# EAGLE design PoE_Atmega_REVB (EAGLE 8.3.1)
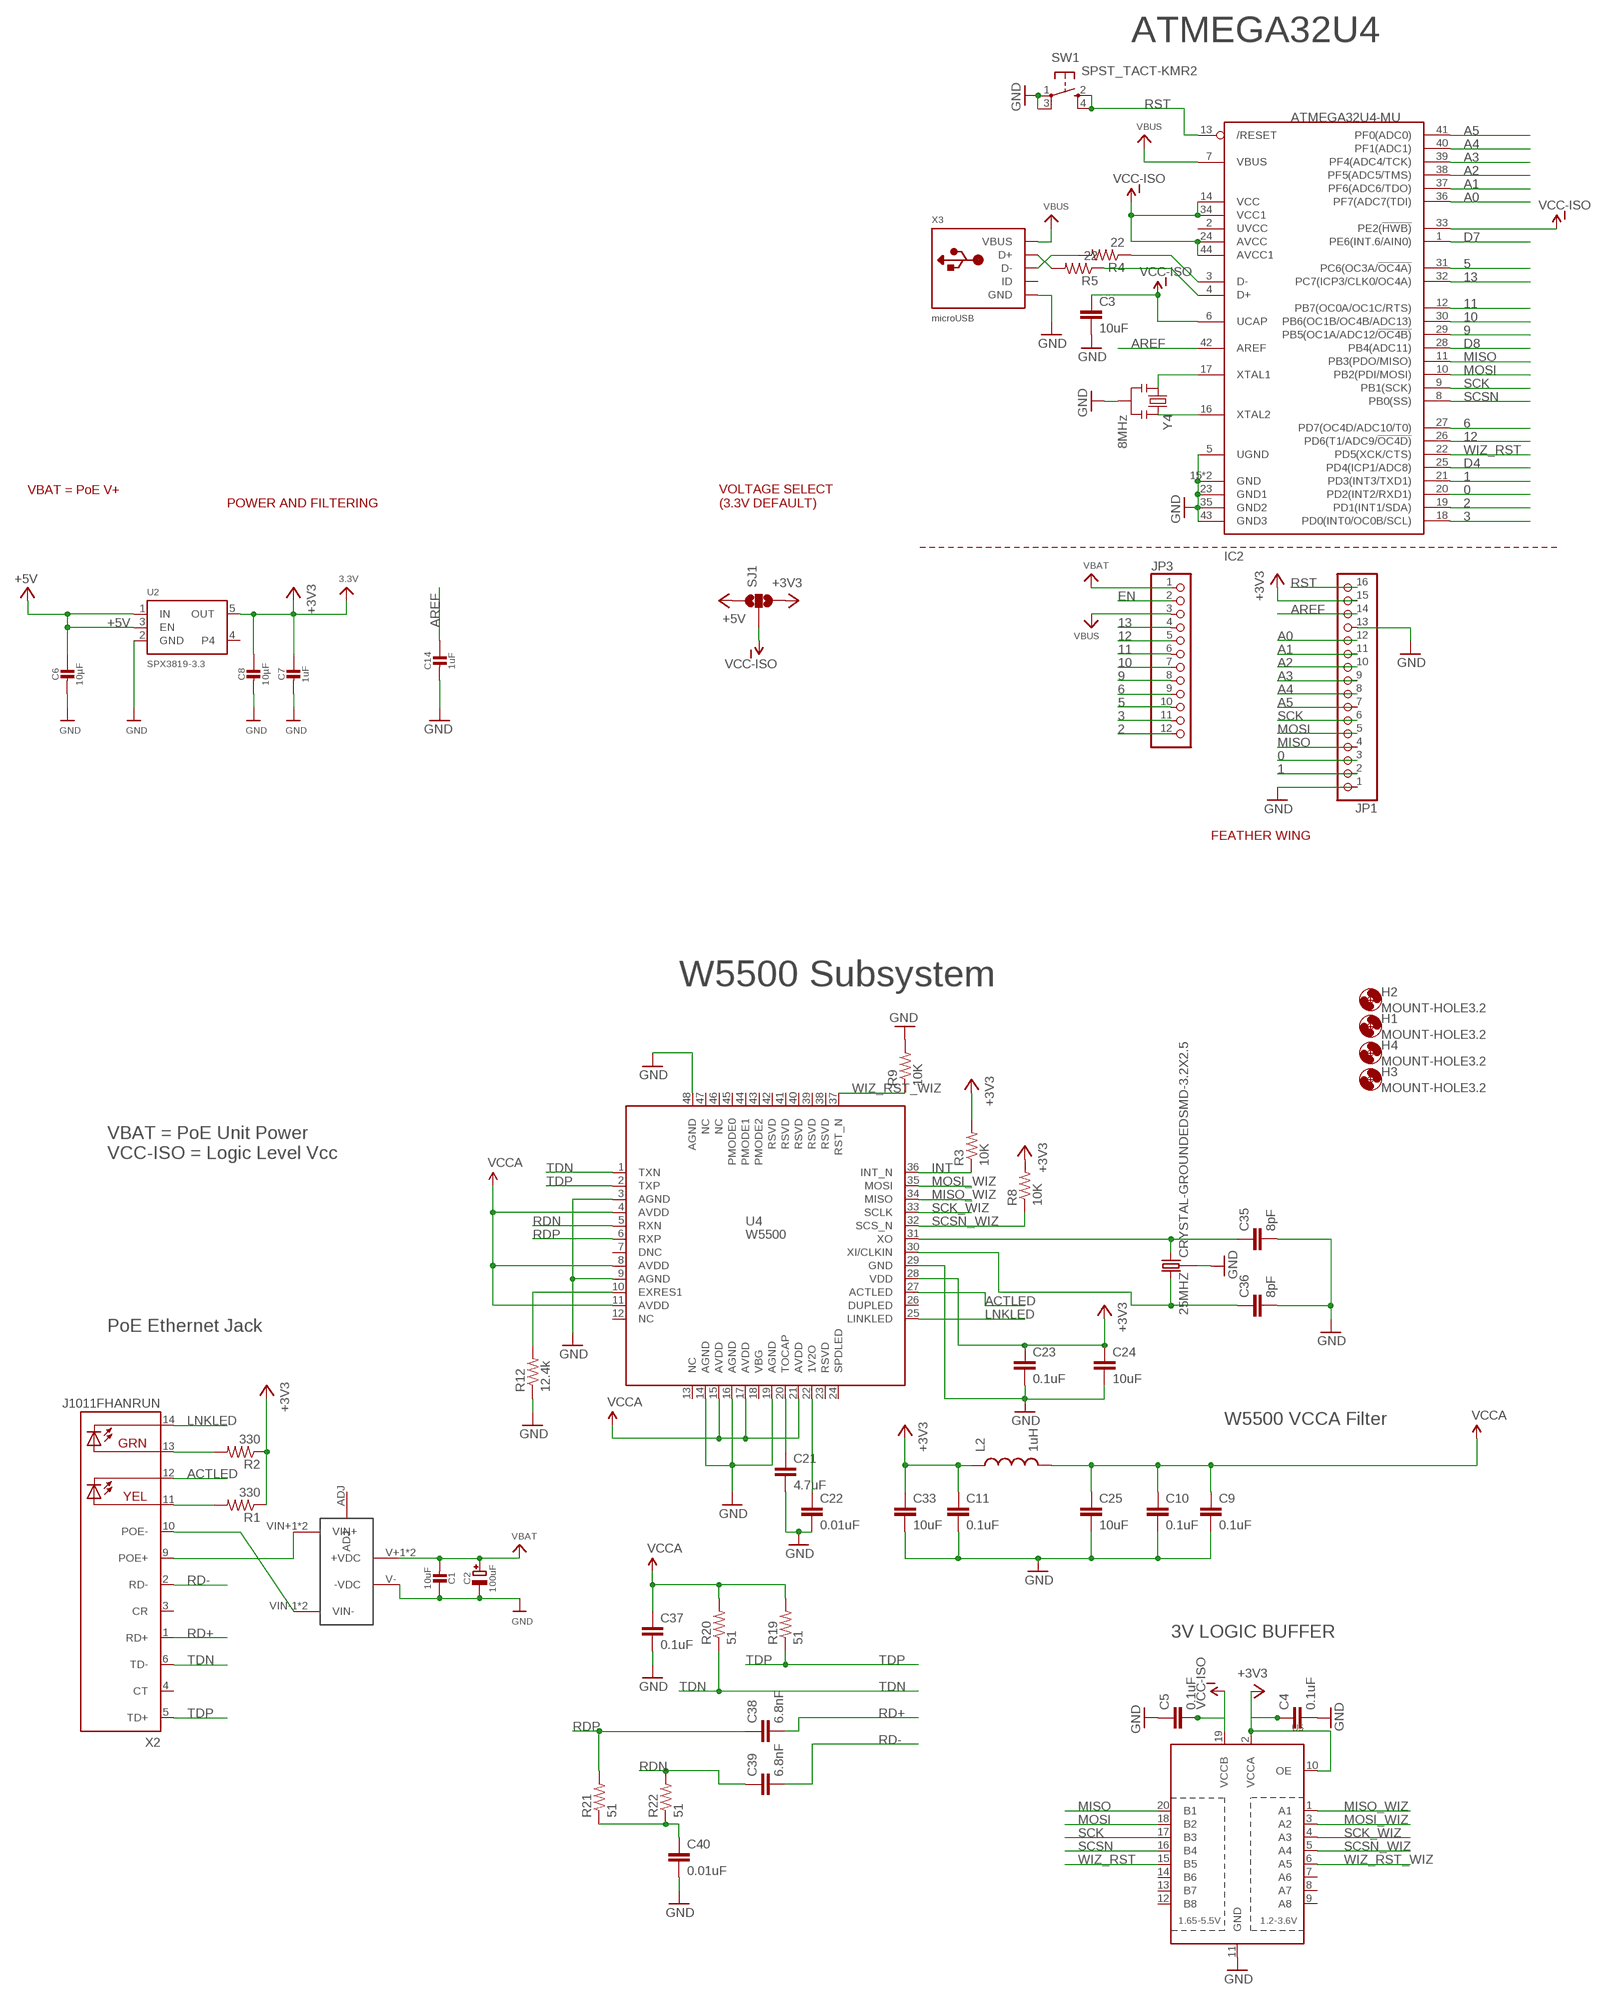
[diagram p0: schematic, sheet 1, part 1 of 2]
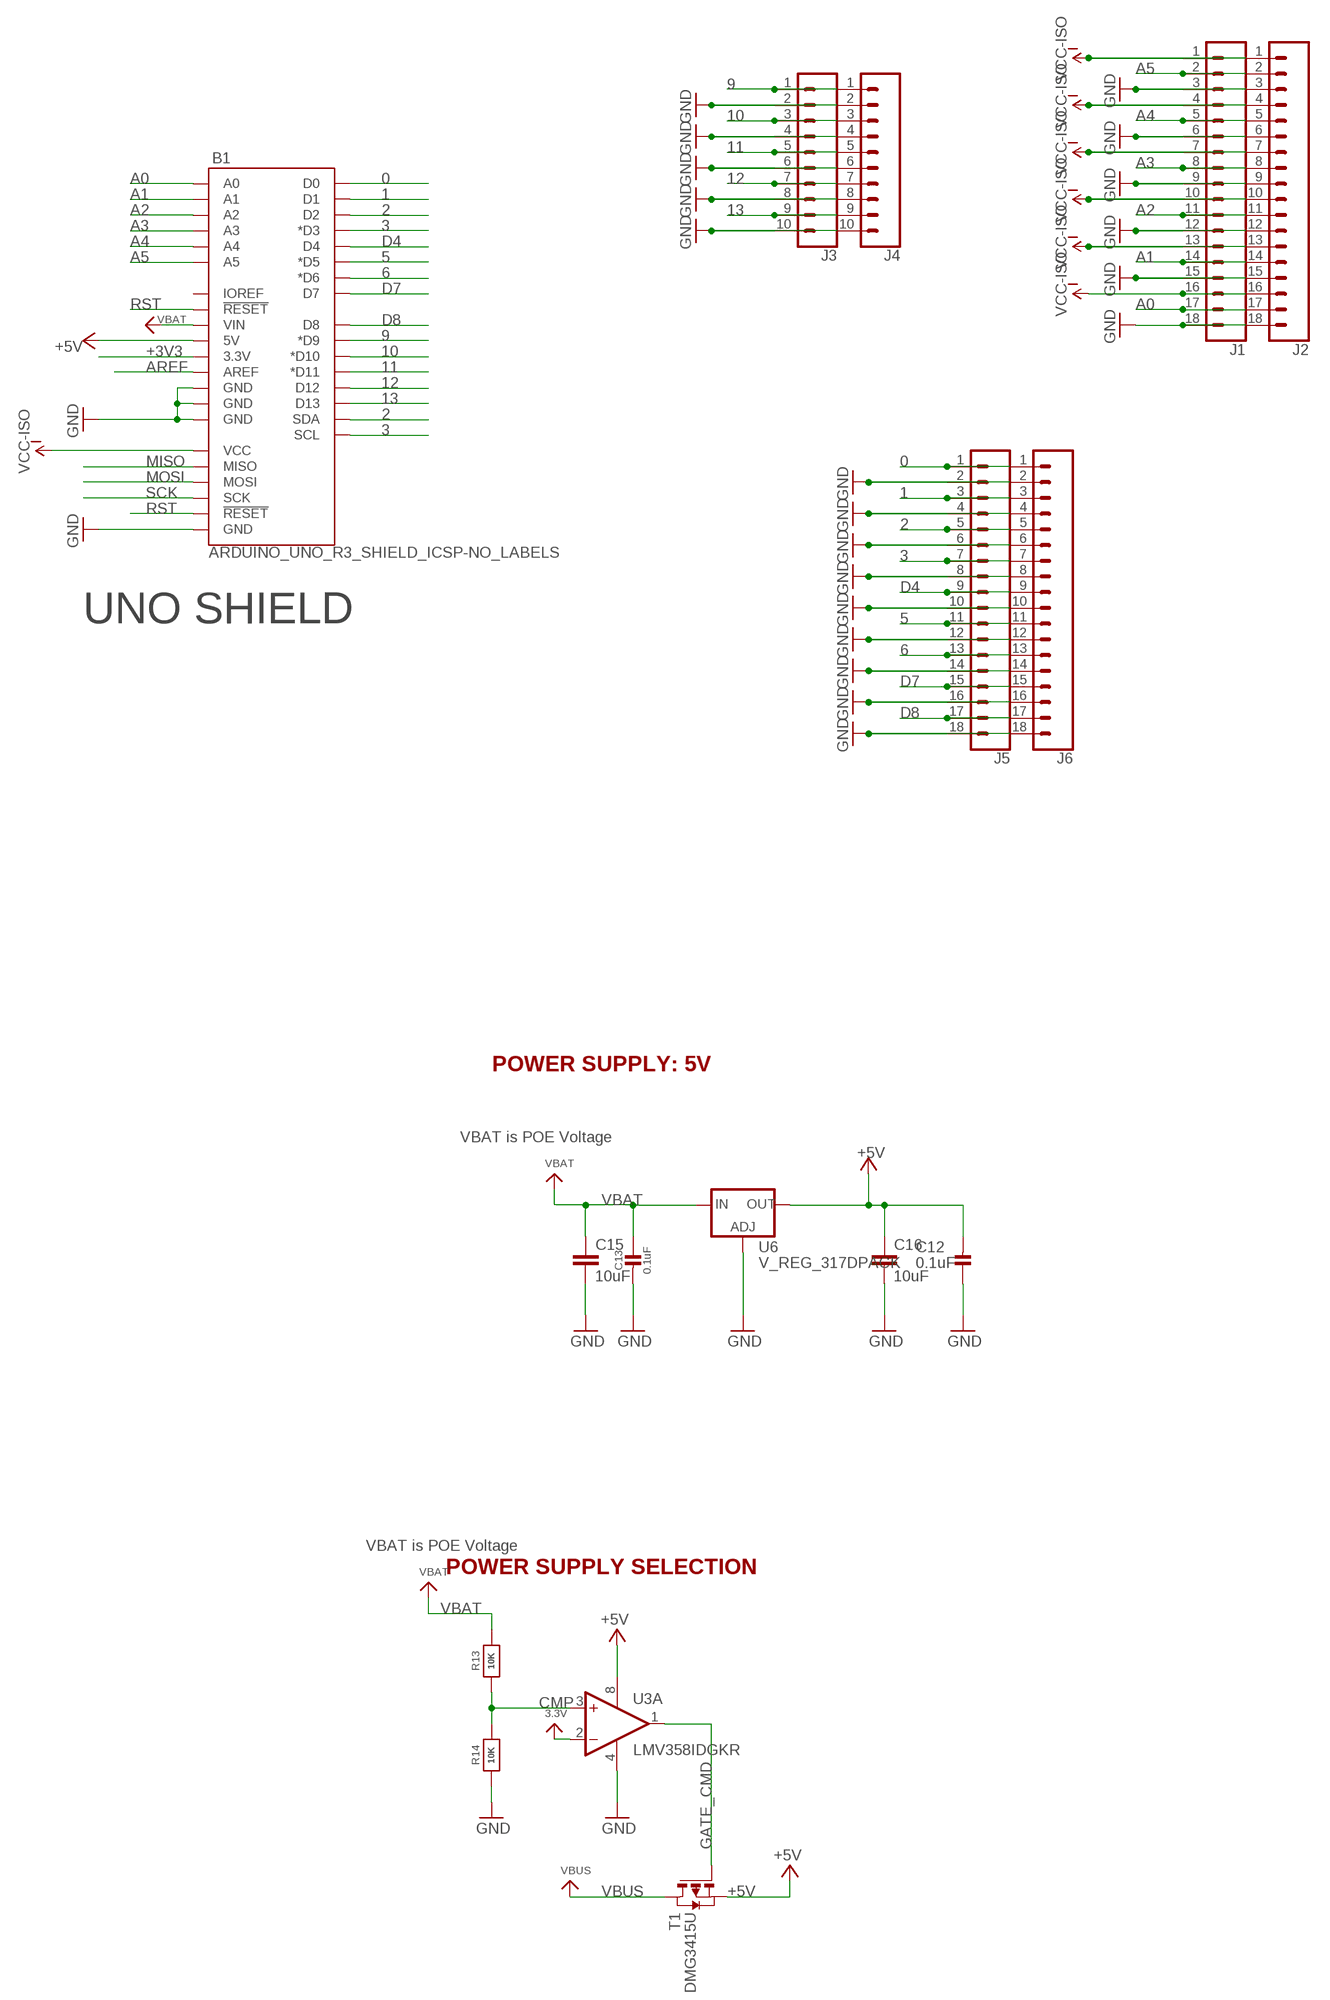
[diagram p1: schematic, sheet 1, part 2 of 2]

## Parts
25MHZ  CRYSTAL-GROUNDEDSMD-3.2X2.5  [CRYSTAL-SMD-3.2X2.5MM]
B1  ARDUINO_UNO_R3_SHIELD_ICSP-NO_LABELS  [UNO_R3_SHIELD_ICSP_NOLABELS]
C1  10uF  CAP_CERAMIC_0805MP  [_0805MP]
C2  100uF  CAP_ELECTROLYTICPANASONIC_C  [PANASONIC_C]
C3  10uF  CAP0603-CAP  [0603-CAP]
C4  0.1uF  CAP0603-CAP  [0603-CAP]
C5  0.1uF  CAP0603-CAP  [0603-CAP]
C6  10µF  CAP_CERAMIC0603MINI  [0603-MINI]
C7  1uF  CAP_CERAMIC0603MINI  [0603-MINI]
C8  10µF  CAP_CERAMIC0603MINI  [0603-MINI]
C9  0.1uF  CAP0603-CAP  [0603-CAP]
C10  0.1uF  CAP0603-CAP  [0603-CAP]
C11  0.1uF  CAP0603-CAP  [0603-CAP]
C12  0.1uF  CAP_CERAMIC0805-NOOUTLINE  [0805-NO]
C13  0.1uF  CAP_CERAMIC0805-NOOUTLINE  [0805-NO]
C14  1uF  CAP_CERAMIC0603_NO  [0603-NO]
C15  10uF  CAP0603-CAP  [0603-CAP]
C16  10uF  CAP0603-CAP  [0603-CAP]
C21  4.7uF  CAP0603-CAP  [0603-CAP]
C22  0.01uF  CAP0603-CAP  [0603-CAP]
C23  0.1uF  CAP0603-CAP  [0603-CAP]
C24  10uF  CAP0603-CAP  [0603-CAP]
C25  10uF  CAP0603-CAP  [0603-CAP]
C33  10uF  CAP0603-CAP  [0603-CAP]
C35  8pF  CAP0603-CAP  [0603-CAP]
C36  8pF  CAP0603-CAP  [0603-CAP]
C37  0.1uF  CAP0603-CAP  [0603-CAP]
C38  6.8nF  CAP0603-CAP  [0603-CAP]
C39  6.8nF  CAP0603-CAP  [0603-CAP]
C40  0.01uF  CAP0603-CAP  [0603-CAP]
H1  MOUNT-HOLE3.2  [3,2]
H2  MOUNT-HOLE3.2  [3,2]
H3  MOUNT-HOLE3.2  [3,2]
H4  MOUNT-HOLE3.2  [3,2]
IC2  ATMEGA32U4-MU  [TQFN44_7MM]
J1  CONN_18  [1X18]
J2  CONN_18  [1X18]
J3  CONN_10"  [1X10]
J4  CONN_10"  [1X10]
J5  CONN_18  [1X18]
J6  CONN_18  [1X18]
JP1  HEADER-1X16ROUND  [1X16_ROUND]
JP3  HEADER-1X12  [1X12_ROUND]
L2  1uH  INDUCTOR0603  [0603]
R1  330  RESISTOR0603-RES  [0603-RES]
R2  330  RESISTOR0603-RES  [0603-RES]
R3  10K  RESISTOR0603-RES  [0603-RES]
R4  22  RESISTOR0603-RES  [0603-RES]
R5  22  RESISTOR0603-RES  [0603-RES]
R8  10K  RESISTOR0603-RES  [0603-RES]
R9  10K  RESISTOR0603-RES  [0603-RES]
R12  12.4k  RESISTOR0603-RES  [0603-RES]
R13  10K  RESISTOR0805_NOOUTLINE  [0805-NO]
R14  10K  RESISTOR0805_NOOUTLINE  [0805-NO]
R19  51  RESISTOR0603-RES  [0603-RES]
R20  51  RESISTOR0603-RES  [0603-RES]
R21  51  RESISTOR0603-RES  [0603-RES]
R22  51  RESISTOR0603-RES  [0603-RES]
SJ1  SOLDERJUMPER_2WAYPASTE2&3  [SJ_3_PASTE2&3]
SW1  SPST_TACT-KMR2  [KMR2]
T1  DMG3415U  PMOSSOT23  [SOT-23]
U2  SPX3819-3.3  VREG_SOT23-5  [SOT23-5]
U3  LMV358IDGKR  LMV358MMX  [MSOP08]
U4  W5500  [W5500]
U5  TXB0108PWR  [TSSOP20]
U6  V_REG_317DPACK  [V-REG_DPACK]
U$1  SILVERTEL_POEMICRO  [AG9900]
X2  J1011FHANRUN  [HANRUN_POE]
X3  microUSB  USB_MICRO_20329_V2  [4UCONN_20329_V2]
Y4  8MHz  RESONATORSMD  [RESONATOR-SMD]

## Nets
0: B1.RX(D0) IC2.20(PD2(INT2/RXD1)) J5.1 J6.1 JP1.3
1: B1.TX(D1) IC2.21(PD3(INT3/TXD1)) J5.3 J6.3 JP1.2
2: B1.D2 B1.SDA IC2.19(PD1(INT1/SDA)) J5.5 J6.5 JP3.12
3: B1.D3(*D3) B1.SCL IC2.18(PD0(INT0/OC0B/SCL)) J5.7 J6.7 JP3.11
5: B1.D5(*D5) IC2.31(PC6(OC3A/!OC4A)) J5.11 J6.11 JP3.10
6: B1.D6(*D6) IC2.27(PD7(OC4D/ADC10/T0)) J5.13 J6.13 JP3.9
9: B1.D9(*D9) IC2.29(PB5(OC1A/ADC12/!OC4B)) J3.1 J4.1 JP3.8
10: B1.D10(*D10) IC2.30(PB6(OC1B/OC4B/ADC13)) J3.3 J4.3 JP3.7
11: B1.D11(*D11) IC2.12(PB7(OC0A/OC1C/RTS)) J3.5 J4.5 JP3.6
12: B1.D12 IC2.26(PD6(T1/ADC9/!OC4D)) J3.7 J4.7 JP3.5
13: B1.D13 IC2.32(PC7(ICP3/CLK0/OC4A)) J3.9 J4.9 JP3.4
+3V3: B1.3.3V C4.1 C7.1 C8.1 C11.1 C23.1 C24.1 C33.1 JP1.15 L2.1 R1.1 R2.1 R3.2 R8.2 SJ1.3 U2.5(OUT) U3.2(A:-IN) U4.28(VDD) U5.2(VCCA) U5.10(OE) ; supply symbol labelled 3.3V
+5V [usbvcc]: B1.5V C6.1 C12.2 C16.1 SJ1.1 T1.2(S) U2.1(IN) U2.3(EN) U3.8(P:V+) U6.4(OUT)
A0: B1.A0 IC2.36(PF7(ADC7(TDI)) J1.17 J2.17 JP1.12
A1: B1.A1 IC2.37(PF6(ADC6/TDO)) J1.14 J2.14 JP1.11
A2: B1.A2 IC2.38(PF5(ADC5/TMS)) J1.11 J2.11 JP1.10
A3: B1.A3 IC2.39(PF4(ADC4/TCK)) J1.8 J2.8 JP1.9
A4: B1.A4 IC2.40(PF1(ADC1)) J1.5 J2.5 JP1.8
A5: B1.A5 IC2.41(PF0(ADC0)) J1.2 J2.2 JP1.7
ACTLED: U4.27(ACTLED) X2.12(YEL-C)
AREF: B1.AREF C14.1 IC2.42(AREF) JP1.14
CMP: R13.1 R14.2 U3.3(A:+IN)
D4: B1.D4 IC2.25(PD4(ICP1/ADC8)) J5.9 J6.9
D7: B1.D7 IC2.1(PE6(INT.6/AIN0)) J5.15 J6.15
D8: B1.D8 IC2.28(PB4(ADC11)) J5.17 J6.17
D+: IC2.4(D+) R5.1
D-: IC2.3(D-) R4.1
EN: JP3.2
GATE_CMD: T1.3(G) U3.1(A:OUT)
GND: 25MHZ.2 25MHZ.4 B1.GND@0(GND) B1.GND@1(GND) B1.GND@2(GND) B1.GND_ICSP(GND) C1.1 C2.- C3.2 C4.2 C5.1 C6.2 C7.2 C8.2 C9.2 C10.2 C11.2 C12.1 C13.2 C14.2 C15.2 C16.2 C21.2 C22.2 C23.2 C24.2 C25.2 C33.2 C35.2 C36.2 C37.2 C40.2 IC2.5(UGND) IC2.15(GND) IC2.23(GND1) IC2.35(GND2) IC2.43(GND3) IC2.THERMAL(GND) J1.3 J1.6 J1.9 J1.12 J1.15 J1.18 J2.3 J2.6 J2.9 J2.12 J2.15 J2.18 J3.2 J3.4 J3.6 J3.8 J3.10 J4.2 J4.4 J4.6 J4.8 J4.10 J5.2 J5.4 J5.6 J5.8 J5.10 J5.12 J5.14 J5.16 J5.18 J6.2 J6.4 J6.6 J6.8 J6.10 J6.12 J6.14 J6.16 J6.18 JP1.1 JP1.13 R9.2 R12.1 R14.1 SW1.1(P) SW1.3(P1) U2.2(GND) U3.4(P:V-) U4.3(AGND) U4.9(AGND) U4.14(AGND) U4.16(AGND) U4.19(AGND) U4.29(GND) U4.48(AGND) U5.11(GND) U6.1(ADJ) U$1.V-(-VDC) X3.BASE@1(GND) X3.BASE@2(GND) X3.GND X3.SPRT@1(GND) X3.SPRT@2(GND) X3.SPRT@3(GND) X3.SPRT@4(GND) Y4.2
INT: R3.1 U4.36(INT_N)
LNKLED: U4.25(LINKLED) X2.14(GRN-C)
MISO: B1.MISO IC2.11(PB3(PDO/MISO)) JP1.4 U5.20(B1)
MISO_WIZ: U4.34(MISO) U5.1(A1)
MOSI: B1.MOSI IC2.10(PB2(PDI/MOSI)) JP1.5 U5.18(B2)
MOSI_WIZ: U4.35(MOSI) U5.3(A2)
N$6: R5.2 X3.D+
N$9: R1.2 X2.11(YEL-A)
N$10: R2.2 X2.13(GRN-A)
N$11: IC2.16(XTAL2) Y4.3
N$12: IC2.17(XTAL1) Y4.1
N$13: R4.2 X3.D-
N$18: C21.1 U4.20(TOCAP)
N$19: C22.1 U4.22(1V2O)
N$20: R12.2 U4.10(EXRES1)
N$23: C40.1 R21.1 R22.1
N$25: 25MHZ.3 C35.1 U4.31(XO)
N$26: 25MHZ.1 C36.1 U4.30(XI/CLKIN)
POE_VIN+: U$1.VIN+1(VIN+) U$1.VIN+2(VIN+) X2.9(POE+)
POE_VIN-: U$1.VIN-1(VIN-) U$1.VIN-2(VIN-) X2.10(POE-)
RD+: C38.2 X2.1(RD+)
RD-: C39.2 X2.2(RD-)
RDN: C39.1 R22.2 U4.5(RXN)
RDP: C38.1 R21.2 U4.6(RXP)
RST: B1.RES(!RESET!) B1.RST_ICSP(!RESET!) IC2.13(/RESET) JP1.16 SW1.2(S) SW1.4(S1)
SCK: B1.SCK IC2.9(PB1(SCK)) JP1.6 U5.17(B3)
SCK_WIZ: U4.33(SCLK) U5.4(A3)
SCSN: IC2.8(PB0(SS)) U5.16(B4)
SCSN_WIZ: R8.1 U4.32(SCS_N) U5.5(A4)
TDN: R20.1 U4.1(TXN) X2.6(TD-)
TDP: R19.1 U4.2(TXP) X2.5(TD+)
VBAT: B1.VIN C1.2 C2.+ C13.1 C15.1 JP3.1 R13.2 U6.3(IN) U$1.V+1(+VDC) U$1.V+2(+VDC)
VBUS: IC2.7(VBUS) JP3.3 T1.1(D) X3.VBUS
VCC-ISO: B1.5V_ICSP(VCC) C3.1 C5.2 IC2.6(UCAP) IC2.14(VCC) IC2.24(AVCC) IC2.33(PE2(!HWB)) IC2.34(VCC1) IC2.44(AVCC1) J1.1 J1.4 J1.7 J1.10 J1.13 J1.16 J2.1 J2.4 J2.7 J2.10 J2.13 J2.16 SJ1.2 U5.19(VCCB)
VCCA: C9.1 C10.1 C25.1 C37.1 L2.2 R19.2 R20.2 U4.4(AVDD) U4.8(AVDD) U4.11(AVDD) U4.15(AVDD) U4.17(AVDD) U4.21(AVDD)
WIZ_RST: IC2.22(PD5(XCK/CTS)) U5.15(B5)
WIZ_RST_WIZ: R9.1 U4.37(RST_N) U5.6(A5)
Unconnected: B1.IOREF IC2.2(UVCC) U2.4 U3.5(B:+IN) U3.6(B:-IN) U3.7(B:OUT) U4.7(DNC) U4.12(NC) U4.13(NC) U4.18(VBG) U4.23(RSVD) U4.24(SPDLED) U4.26(DUPLED) U4.38(RSVD) U4.39(RSVD) U4.40(RSVD) U4.41(RSVD) U4.42(RSVD) U4.43(PMODE2) U4.44(PMODE1) U4.45(PMODE0) U4.46(NC) U4.47(NC) U5.7(A6) U5.8(A7) U5.9(A8) U5.12(B8) U5.13(B7) U5.14(B6) U$1.ADJ X2.3(CR) X2.4(CT) X3.ID

## Notes on the sheet
- ATMEGA32U4
- VBAT = PoE V+
- POWER AND FILTERING
- VOLTAGE SELECT
  (3.3V DEFAULT)
- UNO SHIELD
- FEATHER WING
- W5500 Subsystem
- VBAT = PoE Unit Power
  VCC-ISO = Logic Level Vcc
- POWER SUPPLY: 5V
- VBAT is POE Voltage
- PoE Ethernet Jack
- W5500 VCCA Filter
- VBAT is POE Voltage
- POWER SUPPLY SELECTION
- 3V LOGIC BUFFER

## Library data of the parts
25MHZ = SparkFun-Clocks:CRYSTAL-GROUNDED: Crystals w/ Ground Pin (Generic) These are passive quartz crystals, which can be used as a clock source for a microcontroller. Crystal's are usually two-terminal devices. A third terminal may be optionally connected to ground, as recommended by the manufaturer.
B1 = SparkFun-Boards:ARDUINO_UNO_R3_SHIELD_ICSP: Arduino R3 Shield Footprint with ICSP Header Includes pins for 6-pin (2x3) ICSP Header. Compatible with Leonardo boards that require SPI pin connections via this header. SparkFun Products: CryptoShield <https://www.sparkfun.com/products/13183> microSD Shield <https://www.sparkfun.com/products/12761> R3 Stackable Headers Kit <https://www.sparkfun.com/products/1417>
C1 C6-C8 C12-C14 = microbuilder:CAP_CERAMIC: Ceramic Capacitors For new designs, use the packages preceded by an '_' character since they are more reliable: The following footprints should be used on most boards: _0402 - Standard footprint for regular board layouts _0603 - Standard footprint for regular board layouts _0805 - Standard footprint for regular board layouts _1206 - Standard footprint for regular board layouts For extremely tight-pitch boards where space is at a premium, the following 'micro-pitch' footprints can be used (smaller pads, no silkscreen outline, etc.): _0402MP - Micro-pitch footprint for very dense/compact boards _0603MP - Micro-pitch footprint for very dense/compact boards _0805MP - Micro-pitch footprint for very dense/compact boards _1206MP - Micro-pitch footprint for very dense/compact boards
C2 = microbuilder:CAP_ELECTROLYTIC: Electrolytic Capacitors SMT PANASONIC_C - Size C Panasonic Electrolytic Aluminum Capacitor 47µF 16V 20% Electrolytic Capacitor [Digikey: PCE3890TR-ND] PANASONIC_D - Size D Panasonic Electrolytic Aluminum Capacitor 100µF 25V 20% Electrolytic Capacitor [Digikey: PCE3898TR-ND] PTH 3.5 mm grid, 8 mm diameter ... 3.5 mm grid, 10 mm diameter ...
C3-C5 C9-C11 C15 C16 C21-C25 C33 C35-C40 = SparkFun-Passives:CAP: Capacitor Standard 0603 ceramic capacitor, and 0.1" leaded capacitor.
H1-H4 = holes:MOUNT-HOLE: MOUNTING HOLE with drill center marker
IC2 = microbuilder:ATMEGA32U4: http://www.ladyada.net/library/eagle
J1 J2 J5 J6 = SparkFun-Connectors:CONN_18: Multi connection point. Often used as Generic Header-pin footprint for 0.1 inch spaced/style header connections On any of the 0.1 inch spaced packages, you can populate with these: Break Away Headers - Straight <https://www.sparkfun.com/products/116> (PRT-00116) Break Away Male Headers - Right Angle <https://www.sparkfun.com/products/553> (PRT-00553) Female Headers <https://www.sparkfun.com/products/115> (PRT-00115) Break Away Headers - Machine Pin <https://www.sparkfun.com/products/117> (PRT-00117) Break Away Female Headers - Swiss Machine Pin <https://www.sparkfun.com/products/743> (PRT-00743) For SCREWTERMINALS and SPRING TERMINALS visit here: Screw Terimnals on SparkFun.com <https://www.sparkfun.com/search/results?term=Screw+Terminals> (5mm/3.5mm/2.54mm spacing) This device is also useful as a general connection point to wire up your design to another part of your project. Our various solder wires solder well into these plated through hole pads. Hook-Up Wire - Assortment (Stranded, 22 AWG) <https://www.sparkfun.com/products/11375> (PRT-11375) Hook-Up Wire - Assortment (Solid Core, 22 AWG) <https://www.sparkfun.com/products/11367> (PRT-11367) View the entire wire category on our website here <https://www.sparkfun.com/categories/141> Special notes: Molex polarized connector foot print use with SKU : PRT-08231 with associated crimp pins and housings. 1MM SMD Version SKU: PRT-10208 NOTES ON THE VARIANTS LOCK and LOCK_LONGPADS... This footprint was designed to help hold the alignment of a through-hole component (i.e. 6-pin header) while soldering it into place. You may notice that each hole has been shifted either up or down by 0.005 of an inch from it's more standard position (which is a perfectly straight line). This slight alteration caused the pins (the squares in the middle) to touch the edges of the holes. Because they are alternating, it causes a "brace" to hold the component in place. 0.005 has proven to be the perfect amount of "off-center" position when using our standard breakaway headers. Although looks a little odd when you look at the bare footprint, once you have a header in there, the alteration is very hard to notice. Also,if you push a header all the way into place, it is covered up entirely on the bottom side.
J3 J4 = SparkFun-Connectors:CONN_10: Multi connection point. Often used as Generic Header-pin footprint for 0.1 inch spaced/style header connections On any of the 0.1 inch spaced packages, you can populate with these: Break Away Headers - Straight <https://www.sparkfun.com/products/116> (PRT-00116) Break Away Male Headers - Right Angle <https://www.sparkfun.com/products/553> (PRT-00553) Female Headers <https://www.sparkfun.com/products/115> (PRT-00115) Break Away Headers - Machine Pin <https://www.sparkfun.com/products/117> (PRT-00117) Break Away Female Headers - Swiss Machine Pin <https://www.sparkfun.com/products/743> (PRT-00743) Arduino Stackable Header - 10 Pin <https://www.sparkfun.com/products/11376> (PRT-11376) For SCREWTERMINALS and SPRING TERMINALS visit here: Screw Terimnals on SparkFun.com <https://www.sparkfun.com/search/results?term=Screw+Terminals> (5mm/3.5mm/2.54mm spacing) This device is also useful as a general connection point to wire up your design to another part of your project. Our various solder wires solder well into these plated through hole pads. Hook-Up Wire - Assortment (Stranded, 22 AWG) <https://www.sparkfun.com/products/11375> (PRT-11375) Hook-Up Wire - Assortment (Solid Core, 22 AWG) <https://www.sparkfun.com/products/11367> (PRT-11367) View the entire wire category on our website here <https://www.sparkfun.com/categories/141> Special notes: Molex polarized connector foot print use with SKU : PRT-08231 with associated crimp pins and housings. 1MM SMD Version SKU: PRT-10208 NOTES ON THE VARIANTS LOCK and LOCK_LONGPADS... This footprint was designed to help hold the alignment of a through-hole component (i.e. 6-pin header) while soldering it into place. You may notice that each hole has been shifted either up or down by 0.005 of an inch from it's more standard position (which is a perfectly straight line). This slight alteration caused the pins (the squares in the middle) to touch the edges of the holes. Because they are alternating, it causes a "brace" to hold the component in place. 0.005 has proven to be the perfect amount of "off-center" position when using our standard breakaway headers. Although looks a little odd when you look at the bare footprint, once you have a header in there, the alteration is very hard to notice. Also,if you push a header all the way into place, it is covered up entirely on the bottom side.; PROD_ID: CONN-11563
JP1 = microbuilder:HEADER-1X16: PIN HEADER
JP3 = microbuilder:HEADER-1X12
L2 = SparkFun-Passives:INDUCTOR: Inductors Basic Inductor/Choke - 0603 and 1206. Footprints are not proven and vary greatly between part numbers. INDUCTOR POWER 3.3UH 4.0A SMD 0.197" L x 0.197" W x 0.177" H (5.00mm x 5.00mm x 4.50mm)
R1-R5 R8 R9 R12 R19-R22 = SparkFun-Passives:RESISTOR: Resistor Basic schematic elements and footprints for 0603, 1206, and PTH resistors.
R13 R14 = microbuilder:RESISTOR: Resistors For new designs, use the packages preceded by an '_' character since they are more reliable: The following footprints should be used on most boards: _0402 - Standard footprint for regular board layouts _0603 - Standard footprint for regular board layouts _0805 - Standard footprint for regular board layouts _1206 - Standard footprint for regular board layouts For extremely tight-pitch boards where space is at a premium, the following 'micro-pitch' footprints can be used (smaller pads, no silkscreen outline, etc.): _0402MP - Micro-pitch footprint for very dense/compact boards _0603MP - Micro-pitch footprint for very dense/compact boards _0805MP - Micro-pitch footprint for very dense/compact boards _1206MP - Micro-pitch footprint for very dense/compact boards
SJ1 = SparkFun-Retired:SOLDERJUMPER_2WAY: Solder Jumper 2 way solder jumper
SW1 = adafruit:SPST_TACT: SMT 6mm switch, EVQQ2 series http://www.ladyada.net/library/eagle
T1 = zetex:PMOSSOT23: MOS FET; OC_FARNELL: unknown; OC_NEWARK: unknown
U2 = microbuilder:VREG_SOT23-5: SOT23-5 Fixed Voltage Regulators Part Current Out V Out V In V Dropout θJA (°C/W) TJ (°C) Digikey Part No. ADP121 150mA 3.3V 3.4-5.5V 0.09V @ 150mA -- -- ADP121-AUJZ33R7CT-ND ADP121 150mA 3.0V 3.1-5.5V 0.09V @ 150mA -- -- ADP121-AUJZ30R7CT-ND ADP122 300mA 3.3V 3.4-5.5V 0.085V @ 300mA -- -- ADP122AUJZ-3.3-R7CT-ND ADP1712 300mA 3.3V 3.5-5.5V 0.17V @ 300mA -- -- ADP1712AUJZ-3.3-R7TR-ND AP7311 (Low Cost) 150mA 3.3V 3.5-6V 0.15V @ 150mA -- -- AP7311-33WG-7DICT-ND LD39015M18R 150mA 1.8V 1.9V-5.5V 0.08V @ 100mA -- -- 497-6977-1-ND LP2985A-33DBVR 150mA 3.3V 3.3-16V 0.28V @ 150mA 206 150 296-18479-1-ND MCP1824T-3302E/OT 300mA 3.3V 3.5V-6V 0.2V @ 300mA -- -- MCP1824T-3302E/OTCT-ND MIC5205-2.5YM5 TR 150mA 2.5V 2.7-16V 0.165V @ 150mA -- -- 576-1257-2-ND MIC5205-3.0YM5 TR 150mA 3.0V 3.2V-16V 0.165V @ 150mA -- -- 576-1258-2-ND MIC5205-3.3YM5 TR 150mA 3.3V 3.5V-16V 0.165V @ 150mA -- -- 576-1259-2-ND TPS780330220 150mA 3.3V+2.2V 3.6-5.5V 250mV Max -- -- 296-23332-1-ND TDA3663/N1,135 100mA 3.3V 3.5-45V 0.18V @ 50mA -- -- 568-5343-1-ND Max operating temp can be calculated using θJA, TJ (max junction temperature), and power in watts. Set the "Maximum Ambient Temperature" until it reaches TJ ("Max Junction Temperature"), which is the absolute limit for safe use of the regulator: Heat Sink Temperature Calculator <http://www.daycounter.com/Calculators/Heat-Sink-Temperature-Calculator.phtml> For example, With 12V source into a 3.3V LP2985 and a 30mA load, we are dissipating (12V-3.3V) * 0.03A = 0.261W. With a θJA of 206 °C/W, a TJ of 150°C, and 261mW we can safely use the chip without a heat sink up to 75°C (=147.1°C Junction Temperature).
U3 = linear:LMV358?*: Dual General Purpose, Low Voltage, Rail-to-Rail Output Operational Amplifiers Source: http://www.national.com/mpf/LM/LMV321.html http://www.national.com/dt/lmv_qual.pdf
U4 = W5500:W5500
U5 = adafruit:TXB0108PWR: 8-Bit Bi-Directional Level Shifter 1.2V-3.6V (VCCA) to 1.65V-5.5V (VCCB) bi-directional level shifter with auto direction sensing. Max data rate - VCCA 1.8V: 20Mbps (50ns), VCCA 3.3V: 100Mbps (10ns) Digikey: 296-21527-1-ND
U6 = SparkFun-IC-Power:V_REG_317: Voltage Regulator Standard LM317 adjustable voltage regulator. AOI (Adjust Output Input). Google 'LM317 Calculator' for easy to use app to get the two resistor values needed. 240/720 for 5V output. 240/390 for 3.3V output. Spark Fun Electronics SKU : COM-00527; PROD_ID: IC-09888
U$1 = Heep:SILVERTEL_POE
X2 = Heep:J1011F: PULSEJACK (TM) 1x1 Tab-UP RJ45 10/100 Base-TX RJ45 1x1 Tab-UP with LEDs 8-pin (J1 series) and 6-pin (JP series) integrated magnetics connector, designed to support applications, such as ADSL modems, LAN-on-Motherboard, and Hub and Switches. Source: www.pulseeng.com .. PulseJack-J402.pdf
X3 = microbuilder:USB: USB Connectors USBMINIB - Surface Mount Female Mini-B USB Connector 4UConnector: 06564
Y4 = SparkFun:RESONATOR: Resonator Small SMD resonator. This is the itty bitty 10/20MHz resonators with built in caps. CSTCE10M0G55 and CSTCE20M0V53. Footprint has been reviewed closely but hasn't been tested yet.

## Net classes
1 power: width 0.305 mm, drill 0.483 mm, clearance 0.203 mm
2 gnd: width 0.305 mm, drill 0.483 mm, clearance 0.203 mm
3 usbvcc: width 0.305 mm, drill 0.483 mm, clearance 0.203 mm

## Board
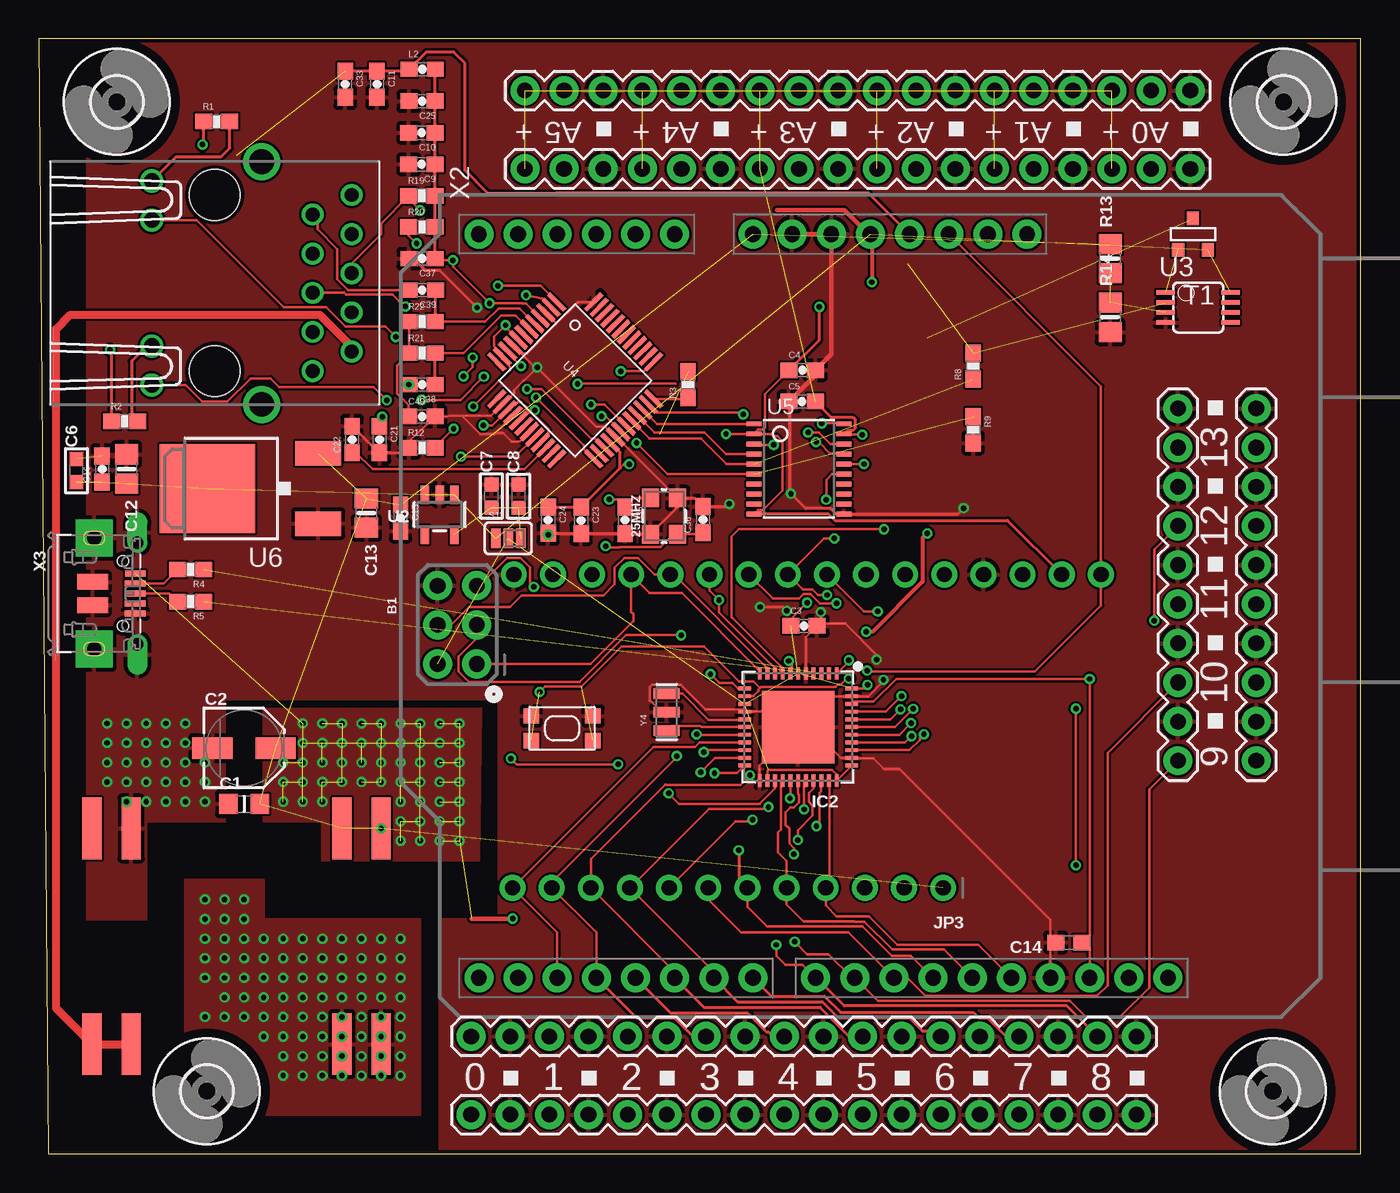
[diagram p2: board, top side]
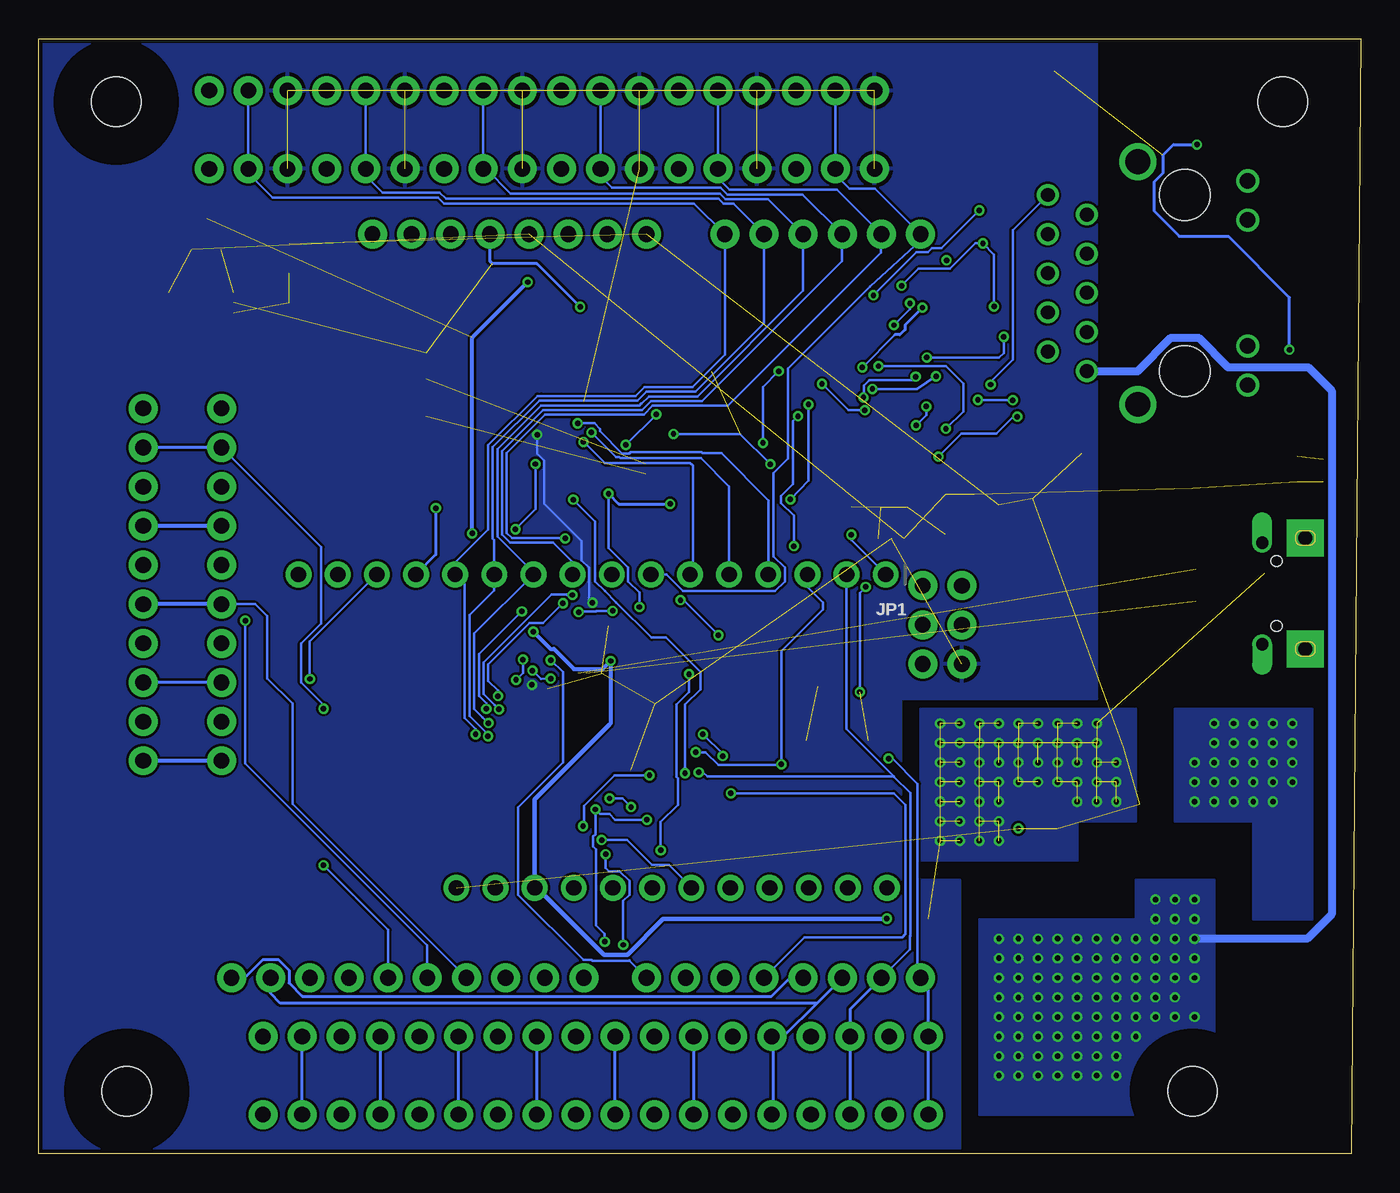
[diagram p3: board, bottom side, seen from below]

Size 85.8 x 72.38 mm. Coordinates in mm from the lower left corner, seen from the top.
Outline: 0.64,0 85.8,0 85.8,72.38 0,72.38 0.64,0
Copper layers (1*16): Top 0.035mm / dielectric 1.5mm / Bottom 0.035mm
Design rules "SeeedStudio_2layer_DRU_no_angle_20140221": minimum track width 6mil, minimum drill 12mil, track to track 6mil, track to pad 6mil, pad to pad 6mil, via to via 6mil, smd to smd 0mil, copper to edge 10mil, drill to drill 10mil, minimum pad ring 10mil, minimum via ring 6mil, stop-mask expansion 2mil, vias tented up to drill 100mil, thermal gap 10mil

### Footprints (pad centres in the part's own frame; a part is rotated, then mirrored left to right if it is on the bottom)
CRYSTAL-SMD-3.2X2.5MM = smd 1.2 x 1.1: 1 -1.175,-0.875; 2 1.175,-0.875; 3 1.175,0.875; 4 -1.175,0.875
UNO_R3_SHIELD_ICSP_NOLABELS = drill 1.016 pad 1.88: 3.3V 24.13,-3.81; 5V 24.13,-1.27; 5V_ICSP -3.76,26.81; A0 24.13,11.43; A1 24.13,13.97; A2 24.13,16.51; A3 24.13,19.05; A4 24.13,21.59; A5 24.13,24.13; AREF -24.13,-15.494; D2 -24.13,19.05; D3 -24.13,16.51; D4 -24.13,13.97; D5 -24.13,11.43; D6 -24.13,8.89; D7 -24.13,6.35; D8 -24.13,2.286; D9 -24.13,-0.254; D10 -24.13,-2.794; D11 -24.13,-5.334; D12 -24.13,-7.874; D13 -24.13,-10.414; GND@0 24.13,1.27; GND@1 24.13,3.81; GND@2 -24.13,-12.954; GND_ICSP 1.32,26.81; IOREF 24.13,-8.89; MISO -3.76,24.27; MOSI -1.22,26.81; NC 24.13,-11.43; RES 24.13,-6.35; RST_ICSP 1.32,24.27; RX -24.13,24.13; SCK -1.22,24.27; SCL -24.13,-20.574; SDA -24.13,-18.034; TX -24.13,21.59; VIN 24.13,6.35
_0805MP = smd 1.2 x 1.3: 1 -1.016,0; 2 1.016,0
PANASONIC_C = smd 2.6 x 1.4: + 2.05,0; - -2.05,0
0603-CAP = smd 1.1 x 1: 1 -0.85,0; 2 0.85,0
0603-MINI = smd 0.9 x 0.9: 1 -0.75,0; 2 0.75,0
0805-NO = smd 1.3 x 1.5: 1 -0.95,0; 2 0.95,0
0603-NO = smd 1.1 x 1: 1 -0.85,0; 2 0.85,0
3,2 = hole 3.2: 0,0
TQFN44_7MM = smd 0.25 x 0.8: 1 -2.5,-3.475; 2 -2,-3.475; 3 -1.5,-3.475; 4 -1,-3.475; 5 -0.5,-3.475; 6 0,-3.475; 7 0.5,-3.475; 8 1,-3.475; 9 1.5,-3.475; 10 2,-3.475; 11 2.5,-3.475; 23 2.5,3.475; 24 2,3.475; 25 1.5,3.475; 26 1,3.475; 27 0.5,3.475; 28 0,3.475; 29 -0.5,3.475; 30 -1,3.475; 31 -1.5,3.475; 32 -2,3.475; 33 -2.5,3.475 | smd 0.8 x 0.25: 12 3.475,-2.5; 13 3.475,-2; 14 3.475,-1.5; 15 3.475,-1; 16 3.475,-0.5; 17 3.475,0; 18 3.475,0.5; 19 3.475,1; 20 3.475,1.5; 21 3.475,2; 22 3.475,2.5; 34 -3.475,2.5; 35 -3.475,2; 36 -3.475,1.5; 37 -3.475,1; 38 -3.475,0.5; 39 -3.475,0; 40 -3.475,-0.5; 41 -3.475,-1; 42 -3.475,-1.5; 43 -3.475,-2; 44 -3.475,-2.5 | smd 4.7 x 4.7: THERMAL 0,0
1X18 = drill 1.016 pad 1.88: 1 0,0; 2 2.54,0; 3 5.08,0; 4 7.62,0; 5 10.16,0; 6 12.7,0; 7 15.24,0; 8 17.78,0; 9 20.32,0; 10 22.86,0; 11 25.4,0; 12 27.94,0; 13 30.48,0; 14 33.02,0; 15 35.56,0; 16 38.1,0; 17 40.64,0; 18 43.18,0
1X10 = drill 1.016 pad 1.88: 1 0,0; 2 2.54,0; 3 5.08,0; 4 7.62,0; 5 10.16,0; 6 12.7,0; 7 15.24,0; 8 17.78,0; 9 20.32,0; 10 22.86,0
1X16_ROUND = drill 1 pad 1.676: 1 -19.05,0; 2 -16.51,0; 3 -13.97,0; 4 -11.43,0; 5 -8.89,0; 6 -6.35,0; 7 -3.81,0; 8 -1.27,0; 9 1.27,0; 10 3.81,0; 11 6.35,0; 12 8.89,0; 13 11.43,0; 14 13.97,0; 15 16.51,0; 16 19.05,0
1X12_ROUND = drill 1 pad 1.676: 1 -13.97,0; 2 -11.43,0; 3 -8.89,0; 4 -6.35,0; 5 -3.81,0; 6 -1.27,0; 7 1.27,0; 8 3.81,0; 9 6.35,0; 10 8.89,0; 11 11.43,0; 12 13.97,0
0603 = smd 1.1 x 1: 1 -0.85,0; 2 0.85,0
0603-RES = smd 1.1 x 1: 1 -0.85,0; 2 0.85,0
SJ_3_PASTE2&3 = smd 0.635 x 1.27: 1 -0.813,0; 2 0,0; 3 0.813,0
KMR2 = smd 1 x 1: 1 2,0.8; 2 2,-0.8; 3 -2,0.8; 4 -2,-0.8
SOT-23 = smd 0.787 x 0.889: 1 0.025,-1.016; 2 -0.94,1.016; 3 0.991,1.016
SOT23-5 = smd 0.55 x 1.2: 1 -0.95,-1.3; 2 0,-1.3; 3 0.95,-1.3; 4 0.95,1.3; 5 -0.95,1.3
MSOP08 = smd 0.3 x 1.2: 1 -0.976,-2.113; 2 -0.326,-2.113; 3 0.324,-2.113; 4 0.974,-2.113; 5 0.974,2.112; 6 0.324,2.112; 7 -0.326,2.112; 8 -0.976,2.112
W5500 = smd 1.5 x 0.3: 1 -4.45,2.75; 2 -4.45,2.25; 3 -4.45,1.75; 4 -4.45,1.25; 5 -4.45,0.75; 6 -4.45,0.25; 7 -4.45,-0.25; 8 -4.45,-0.75; 9 -4.45,-1.25; 10 -4.45,-1.75; 11 -4.45,-2.25; 12 -4.45,-2.75; 25 4.45,-2.75; 26 4.45,-2.25; 27 4.45,-1.75; 28 4.45,-1.25; 29 4.45,-0.75; 30 4.45,-0.25; 31 4.45,0.25; 32 4.45,0.75; 33 4.45,1.25; 34 4.45,1.75; 35 4.45,2.25; 36 4.45,2.75 | smd 0.3 x 1.5: 13 -2.75,-4.45; 14 -2.25,-4.45; 15 -1.75,-4.45; 16 -1.25,-4.45; 17 -0.75,-4.45; 18 -0.25,-4.45; 19 0.25,-4.45; 20 0.75,-4.45; 21 1.25,-4.45; 22 1.75,-4.45; 23 2.25,-4.45; 24 2.75,-4.45; 37 2.75,4.45; 38 2.25,4.45; 39 1.75,4.45; 40 1.25,4.45; 41 0.75,4.45; 42 0.25,4.45; 43 -0.25,4.45; 44 -0.75,4.45; 45 -1.25,4.45; 46 -1.75,4.45; 47 -2.25,4.45; 48 -2.75,4.45
TSSOP20 = smd 0.305 x 0.991: 1 -2.925,-2.918; 2 -2.275,-2.918; 3 -1.625,-2.918; 4 -0.975,-2.918; 5 -0.325,-2.918; 6 0.325,-2.918; 7 0.975,-2.918; 8 1.625,-2.918; 9 2.275,-2.918; 10 2.925,-2.918; 11 2.925,2.918; 12 2.275,2.918; 13 1.625,2.918; 14 0.975,2.918; 15 0.325,2.918; 16 -0.325,2.918; 17 -0.975,2.918; 18 -1.625,2.918; 19 -2.275,2.918; 20 -2.925,2.918
V-REG_DPACK = smd 1.6 x 3: 1 -2.28,-4.8; 3 2.28,-4.8 | smd 5.8 x 6.2: 4 0,2.38
AG9900 = smd 1.25 x 4: ADJ 18.75,0; V+1 0,0; V+2 2.54,0; V- 16.21,0; VIN+1 18.75,14; VIN+2 16.21,14; VIN-1 2.54,14; VIN-2 0,14
HANRUN_POE = drill 0.9 pad 1.3: 1 5.715,-8.89; 2 4.445,-6.35; 3 3.175,-8.89; 4 1.905,-6.35; 5 0.635,-8.89; 6 -0.635,-6.35; 7 -1.905,-8.89; 8 -3.175,-6.35; 9 -4.445,-8.89; 10 -5.715,-6.35 | drill 1 pad 1.422: 11 6.625,4.08; 12 4.085,4.08; 13 -4.085,4.08; 14 -6.625,4.08 | drill 1.6 pad 2.184: M1 7.875,-3.05; M2 -7.875,-3.05 | hole 3.3: -5.715,0; 5.715,0
4UCONN_20329_V2 = smd 1 x 2: BASE@1 -0.75,-2; BASE@2 0.75,-2 | smd 0.4 x 1.35: D+ 0,0.775; D- -0.65,0.775; GND 1.3,0.775; ID 0.65,0.775 | drill 0.8 pad 1.143 offset: SPRT@1 -3.3,0.9; SPRT@2 3.3,0.9 | drill 0.9 pad 2.413 square: SPRT@3 -3.6,-1.9; SPRT@4 3.6,-1.9 | smd 0.4 x 1.321: VBUS -1.3,0.775 | hole 0.7: -2.108,-0.025; 2.108,-0.025
RESONATOR-SMD = smd 0.7 x 1.7: 1 -1.2,0; 2 0,0; 3 1.2,0

### Placement (x,y rotation side)
25MHZ  40.59,41.39 90 top
B1  52.71,35.56 90 top
C1  13.34,22.71 0 top
C2  13.34,26.34 0 top
C3  49.67,34.26 0 top
C4  49.55,50.86 0 top
C5  49.55,48.83 0 top
C6  2.46,44.34 90 top
C7  29.39,42.7 90 top
C8  31.15,42.68 90 top
C9  24.87,64.21 180 top
C10  24.87,66.26 180 top
C11  21.96,69.42 270 top
C12  5.71,44.45 270 top
C13  21.27,41.59 270 top
C14  66.85,13.72 180 top
C15  23.49,41.28 270 top
C16  4.13,44.45 90 top
C21  22.13,46.37 270 top
C22  20.35,46.37 90 top
C23  35.21,41.12 270 top
C24  33.07,41.13 270 top
C25  24.88,68.32 180 top
C33  19.9,69.42 270 top
C35  38.05,41.12 270 top
C36  43.11,41.17 90 top
C37  24.88,58.1 180 top
C38  24.88,49.92 180 top
C39  24.9,56.06 180 top
C40  24.87,47.85 0 top
H1  80.77,68.27 0 top
H2  10.92,4.07 0 top
H3  5.08,68.27 0 top
H4  80.08,4.07 0 top
IC2  49.29,27.7 180 top
J1  31.55,69 0 top
J2  31.55,63.92 0 top
J3  79.01,25.52 90 top
J4  73.93,25.52 90 top
J5  28.06,2.55 0 top
J6  28.06,7.63 0 top
JP1  49.89,37.6 180 bottom
JP3  44.73,17.27 180 top
L2  24.9,70.39 0 top
R1  11.56,66.99 0 top
R2  5.59,47.53 0 top
R3  42.14,49.92 90 top
R4  9.87,37.93 180 top
R5  9.87,35.85 180 top
R8  60.64,51.12 90 top
R9  60.64,46.99 270 top
R12  24.88,45.82 0 top
R13  69.53,58.1 90 top
R14  69.53,54.29 90 top
R19  24.87,62.18 0 top
R20  24.88,60.14 0 top
R21  24.89,51.97 0 top
R22  24.89,54.01 0 top
SJ1  30.48,39.95 0 top
SW1  33.97,27.62 0 top
T1  74.93,59.69 180 top
U2  26.03,41.49 180 top
U3  75.25,54.93 270 top
U4  34.82,50.2 315 top
U5  49.34,44.45 270 top
U6  13.34,43.18 90 top
U$1  22.22,21.13 180 top
X2  11.43,56.52 90 top
X3  5.5,36.37 270 top
Y4  40.75,28.67 90 top

### Tracks (layer width: path | path; a pad name or v marks a point on that pad's centre or on a via)
0  (via drill 0.35)
  Top 0.152: v43.16,26.07 43.3,26.2 IC2.20 | v30.65,25.66 31.01,25.29 v37.6,25.29
  Bottom 0.152: B1.RX 28.76,11.62 28.76,24.02 30.4,25.66 v30.65,25.66 | v43.16,26.07 42.52,26.07 41.69,25.24 37.65,25.24 v37.6,25.29 37.6,32.64 34.91,35.34 34.91,35.8 35.91,36.81 JP1.3
  Bottom 0.2: B1.RX 28.06,10.92 28.06,7.79 | 28.06,7.79 J6.1 | J5.1 28.06,7.79
1  (via drill 0.35)
  Top 0.152: v42.97,24.77 43.9,25.7 IC2.21
  Bottom 0.152: B1.TX 29.26,13.28 29.26,14.14 29.24,14.16 29.24,23.42 30.29,24.47 | JP1.2 33.38,27.58 30.29,24.5 30.29,24.47 | 30.29,24.47 30.32,24.5 42.42,24.5 42.69,24.77 v42.97,24.77
  Bottom 0.2: B1.TX 33.15,9.4 J6.3 J5.3
2
  Top 0.152: B1.D2 33.66,14.37 JP3.12 39.9,26.41 42.58,26.41 42.87,26.7 IC2.19
  Bottom 0.2: B1.D2 35.3,9.79 | 35.3,9.79 70.11,9.79 70.74,10.41 B1.SDA | 35.3,9.79 37.46,7.63 38.12,7.63 | 38.12,7.63 J6.5 | J5.5 38.12,2.66 38.12,7.63
3  (via drill 0.35)
  Top 0.152: B1.D3 36.2,14.37 JP3.11 33.3,17.62 41.41,25.73 v41.41,25.82 | v42.7,27.23 42.8,27.2 IC2.18
  Top 0.2: B1.D3 38.8,8.82 41.26,8.82 42.45,7.63 J6.7
  Bottom 0.152: v42.7,27.23 41.41,25.95 v41.41,25.82 | 73.26,11.43 B1.SCL
  Bottom 0.2: B1.D3 37.05,11.43 38.24,10.24 68.69,10.24 69.55,11.09 69.55,11.92 70.24,12.62 71.23,12.62 72.42,11.43 B1.SCL | J6.7 J5.7
5  (via drill 0.35)
  Top 0.152: 35.85,17.25 JP3.10 | 35.85,17.25 41.27,11.83 B1.D5 | 40.66,23.97 40.66,23.96 | 40.66,23.96 35.85,19.16 35.85,17.25 | v50.48,21.27 50.67,21.41 50.67,23.43 50.77,23.54 50.77,24.21 IC2.31 | 40.66,23.96 45.56,23.96 v46.16,24.57
  Top 0.2: B1.D5 43.18,9.53 50.71,9.53 52.53,7.71 52.58,7.71 52.67,7.63 J6.11
  Bottom 0.152: v46.16,24.57 48.43,24.57 50.41,22.59 50.41,21.34 v50.48,21.27
  Bottom 0.2: J5.11 J6.11
6  (via drill 0.35)
  Top 0.152: v47.37,22.51 47.26,22.41 43.51,22.41 JP3.9 43.82,11.83 B1.D6 | IC2.27 48.79,23.1 v48.76,23.07
  Top 0.2: B1.D6 45.37,9.88 50.86,9.88 51.92,8.82 56.5,8.82 57.34,7.98 57.77,7.98 58.13,7.63 J6.13
  Bottom 0.152: v48.76,23.07 47.92,23.07 v47.37,22.51
  Bottom 0.2: J5.13 J6.13
9  (via drill 0.35)
  Top 0.152: JP3.8 45.24,21.59 46.23,21.59 v46.33,21.69 | v49.07,13.77 49.87,12.97 51.27,12.97 52.8,11.43 B1.D9 54.46,9.93 66.9,9.93 67.94,8.89 70.17,8.89 72.07,10.79 72.07,23.66 J4.1 | IC2.29 49.67,24.11 v49.67,22.36
  Bottom 0.152: v46.33,21.69 48.39,21.69 48.77,22.07 49.38,22.07 v49.67,22.36 49.67,20.75 49.82,20.6 49.82,19.97 49.62,19.77 49.62,14.84 49.07,14.29 v49.07,13.77
  Bottom 0.254: J4.1 J3.1
10  (via drill 0.35)
  Top 0.152: JP3.7 43.46,16.48 45.57,14.37 52.56,14.37 B1.D10 56.39,11.43 57.55,10.26 68.68,10.26 69.37,10.95 69.37,26.04 J4.3 | v49.27,20.37 49.27,21 50.23,21.97 50.23,22.59 49.98,22.83 49.98,23.42 50.29,23.72 IC2.30
  Bottom 0.152: v49.27,20.37 47.62,20.37 46,18.75 44.89,18.75 43.46,17.32 JP3.7
  Bottom 0.2: J4.3 J3.3
11  (via drill 0.35)
  Top 0.152: B1.D11 56.6,12.87 55.37,12.87 53.47,14.77 47.27,14.77 46,16.04 46,17.18 JP3.6 | IC2.12 45.38,30.2 45.03,30.55 44.19,30.55 v43.6,31.14
  Top 0.2: v45.43,19.71 45.43,17.74 46,17.18
  Bottom 0.152: v45.43,19.71 45.43,21.54 44.32,22.66 44.32,24.38 44.41,24.48 44.41,29.17 43.6,29.98 v43.6,31.14 | B1.D11 69.33,22.72 69.33,29.23 70.97,30.87 70.97,34.89 71.76,35.68 74.09,35.68
  Bottom 0.254: J4.5 74.09,35.68 J3.5
12  (via drill 0.35)
  Top 0.152: B1.D12 58.74,13.27 55.4,13.27 53.59,15.07 52.98,15.07 52.95,15.11 49.63,15.11 48.54,16.2 JP3.5 48.54,19.02 47.99,19.56 47.99,20.88 48.16,21.06 48.16,24.1 IC2.26 | v72.39,34.61 72.39,39.22 J4.7
  Bottom 0.152: B1.D12 60.58,13.54 72.39,25.35 v72.39,34.61
  Bottom 0.254: J4.7 J3.7
13  (via drill 0.35)
  Top 0.152: B1.D13 60.98,13.57 58.87,13.57 55.73,13.57 53.89,15.41 51.78,15.41 51.08,16.12 JP3.4 51.08,17.57 51.32,17.82 51.32,24.2 IC2.32 | v67.31,18.73 v67.31,28.89
  Bottom 0.152: B1.D13 63.12,14.54 v67.31,18.73 | J4.9 67.46,39.37 67.46,34.42 68.75,33.13 68.75,30.59 67.31,29.15 v67.31,28.89
  Bottom 0.2: J4.9 J3.9
+3V3  (via drill 0.35)  (8 unrouted)
  Top 0.152: 37.11,46.17 U4.28 | v38.32,44.76 38,44.76 37.74,44.5 | U5.2 v44.61,46.72 | U5.2 46.69,46.99 47.02,46.99 47.15,47.12 47.15,49.31 C4.1 | U5.10 46.69,41.79 47.02,41.79 48.26,43.03 48.26,46.25 47.93,46.57 47.71,46.57 47.56,46.72 U5.2
  Top 0.2: 4.74,51.45 R2.1 4.74,47.17 | B1.3.3V 53.85,62.35 33.56,62.35 33.53,62.33 29.17,62.33 27.67,63.83 27.67,70.77 26.94,71.5 25.16,71.5 L2.1 23.92,70.27 C11.1 | C24.1 33.08,41.97 C23.1 37.74,44.5 37.74,45.54 37.11,46.17 | U5.10 51.26,41.52 51.66,41.12 62.88,41.12 JP1.15 | C11.1 | C11.1 C33.1 | v10.64,65.5 10.71,65.57 R1.1
  Top 0.203: C4.1 50.66,52.82 v50.66,54.97 | 4.74,51.45 4.74,52.08 v4.64,52.18
  Bottom 0.152: v44.61,46.72 40.29,46.72 v38.32,44.76
  Bottom 0.2: v4.64,52.18 4.64,55.58 8.61,59.55 11.79,59.55 | 12.86,64.81 12.17,65.5 v10.64,65.5
  Bottom 0.203: v50.66,54.97 53.47,57.77 56.37,57.77 56.52,57.92 B1.3.3V | 12.86,64.81 12.86,63.63 13.44,63.06 13.44,61.2 11.79,59.55
+5V  (9 unrouted)
A0  (via drill 0.35)
  Top 0.152: v57.45,27.23 57.2,26.98 57.2,26.88 56.52,26.2 IC2.36
  Bottom 0.152: v57.45,27.23 57.45,27.59 58.15,28.28 58.15,36.97 JP1.12 58.77,38.37 56.64,40.51 56.64,45.99 53.44,49.19 53.19,49.19 | 53.19,49.19 | 53.19,49.19 47.07,49.19 46.49,49.77 43.37,49.77 41.27,51.87 B1.A0 43.26,61.68 59.5,61.68 59.88,62.06 70.61,62.06 72.19,63.65 J2.17 | J2.17 | J2.17 J1.17
A1  (via drill 0.35)
  Top 0.152: v56.64,27.11 56.23,26.7 IC2.37
  Bottom 0.152: v56.64,27.11 56.64,27.21 57.84,28.41 57.84,34.96 56.23,36.57 JP1.11 56.23,39.83 56.34,39.93 56.34,45.86 53.31,48.88 53.06,48.88 | 53.06,48.88 | 53.06,48.88 46.94,48.88 46.36,49.47 43.18,49.47 38.73,53.91 B1.A1 40.7,61.65 41.36,61.65 41.68,61.98 59.37,61.98 59.77,62.38 63.47,62.38 64.57,63.49 J2.14 J1.14
A2  (via drill 0.35)
  Top 0.152: v56.61,27.96 55.85,27.2 IC2.38
  Bottom 0.152: 56.98,28.33 | 56.98,28.33 v56.61,27.96 | 56.98,28.33 57.54,28.89 57.54,33.76 JP1.10 53.7,37.72 56.03,40.05 56.03,45.73 53.19,48.58 46.82,48.58 46.71,48.69 46.68,48.69 46.21,49.16 43.05,49.16 36.2,56.02 B1.A2 38.46,61.96 41.23,61.96 41.6,62.33 55.17,62.33 56.76,63.92 J2.11 J1.11
A3  (via drill 0.35)
  Top 0.152: JP1.9 53.54,35.21 v54.45,35.21 | v56.75,28.89 55.56,27.7 IC2.39
  Bottom 0.152: v56.75,28.89 56.75,29.25 57.23,29.73 57.23,32.43 v54.45,35.21 | JP1.9 51.16,38.42 52.42,39.68 55.22,39.68 55.73,40.18 55.73,45.61 53.06,48.27 46.66,48.27 46.08,48.86 42.75,48.86 33.67,57.94 33.67,59.68 B1.A3 36.23,62.26 41.1,62.26 41.54,62.7 48.59,62.7 49.34,63.45 J2.8 J1.8
A4  (via drill 0.35)
  Top 0.152: v51.16,36.27 50.58,36.27 50.22,36.63 49.58,36.63 JP1.8 50.96,39.95 v51.63,39.95 | v55.93,28.86 55.27,28.2 IC2.40
  Bottom 0.152: v51.16,36.27 51.52,36.27 51.55,36.3 52.51,36.3 56.93,31.88 56.93,29.85 56.22,29.15 | 56.22,29.15 | 56.22,29.15 v55.93,28.86 | v51.63,39.95 51.67,39.98 55.09,39.98 55.42,40.31 55.42,45.48 52.93,47.97 46.53,47.97 45.95,48.55 41.08,48.55 31.13,58.5 31.13,59.67 B1.A4 33.99,62.57 40.98,62.57 41.72,63.31 41.72,64.01 | 41.72,64.01 J1.5 | 41.72,64.01 J2.5
A5  (via drill 0.35)
  Top 0.152: v51.78,35.74 51.42,35.74 51.4,35.71 50.71,35.71 50.09,36.33 49.64,36.33 49.34,36.03 47.64,36.03 JP1.7 | v55.99,29.71 54.99,28.7 IC2.41
  Bottom 0.152: v55.99,29.71 55.99,30.06 56.62,30.69 56.62,31.75 53.93,34.44 53.07,34.44 v51.78,35.74 | JP1.7 45.04,37.6 43.98,36.53 38.01,36.53 37.39,37.16 37.39,38.04 38.13,38.78 38.13,44.17 37.17,45.13 37.17,50.97 31.87,56.28 28.57,59.27 B1.A5 31.53,62.65 33.18,62.65 34.09,63.57 J2.2 J1.2
ACTLED  (via drill 0.35)
  Top 0.152: v28.17,51.68 28.17,51.06 v27.57,50.46 | U4.27 36.09,46.44 35.84,46.44 32.64,49.64 v31.7,49.64 | X2.12 10.26,60.6 15.91,54.95 18.66,54.95 19.93,53.68 22.52,53.68 v23.18,53.02
  Bottom 0.152: v31.7,49.64 28.8,49.62 v27.57,50.46 | v28.17,51.68 28.15,51.67 23.49,51.67 23.18,51.98 v23.18,53.02
AREF  (via drill 0.35)
  Top 0.152: IC2.42 52.91,29.35 54.19,29.35 55.66,30.82 v68.2,30.82 68.2,14.22 67.77,13.79 | 67.77,13.79 C14.1 | B1.AREF 68.2,13.36 67.77,13.79
  Bottom 0.152: v68.2,30.82 68.2,33.26 JP1.14
CMP  (2 unrouted)
D4  (via drill 0.35)
  Top 0.152: IC2.25 47.79,23.72 46.81,22.74 46.81,22.71 41.57,22.71 v40.88,23.4
  Top 0.2: B1.D4 40.99,9.18 45.99,9.18 47.23,7.93 47.37,7.93 47.66,7.63 J6.9
  Bottom 0.152: B1.D4 36.09,14.07 29.76,14.07 29.54,14.29 29.54,22.64 30.3,23.4 v40.88,23.4
  Bottom 0.2: J5.9 J6.9
D7  (via drill 0.35)
  Top 0.152: IC2.1 52.66,32.05 52.59,32.05 v52.57,32.04
  Top 0.2: B1.D7 47.55,10.23 51.01,10.23 52.06,9.18 60.65,9.18 61.01,8.82 61.58,8.82 62.77,7.63 J6.15
  Bottom 0.152: v52.57,32.04 51.77,31.27 51.77,25.41 54.68,22.49 54.68,16.83 50.45,12.6 49.94,12.6 49.86,12.52 47.45,12.52 | 47.45,12.52 47.45,12.56 | 47.45,12.52 B1.D7
  Bottom 0.2: J5.15 J6.15
D8  (via drill 0.35)
  Top 0.152: B1.D8 49.58,12.27 48.47,12.27 47.87,12.87 v47.87,13.57 | IC2.28 49.29,23.35 49.36,23.28 49.36,22.82 49.03,22.5 48.79,22.5 48.47,22.18 48.47,21.36 48.71,21.12 48.71,20.14 49.01,19.84 v49.01,19.45
  Top 0.2: J6.17 66.73,9.61 52.29,9.61 50.47,11.43 B1.D8
  Bottom 0.152: v47.87,13.57 47.87,16.43 47.47,16.83 47.47,17.71 48.09,18.34 48.79,18.34 49.01,18.55 v49.01,19.45
  Bottom 0.2: J5.17 J6.17
D+  (1 unrouted)
D-  (1 unrouted)
GATE_CMD  (1 unrouted)
GND  (via drill 0.35)  (1 unrouted)
  Top 0.152: 24.02,46.22 C40.2 27.44,47.92 | 35.01,55.29 U4.48 | 35.01,55.29 34.98,55.29 | 32.21,51.04 U4.9 30.96,52.46 31.47,51.95 31.71,51.95 33.56,53.8 | 27.44,47.92 28.64,46.73 29.58,46.73 29.63,46.77 | 27.44,47.92 29.36,47.92 U4.14 30.12,48.64 30.85,49.37 30.85,49.58 31.47,50.2 31.51,50.2 v32.35,51.04 36.19,47.21 36.77,47.21 37.44,46.55 U4.29 37.51,46.52 25MHZ.2 | B1.GND@2 65.66,13.38 | 65.66,13.38 C14.2 | 65.66,13.38 65.66,15.18 55.87,24.97 54.87,24.97 54.16,25.67 52.8,25.67 IC2.35 52.06,25.7 49.79,27.98 49.68,28.09 | IC2.5 49.79,33.53 C3.2 | 47.66,25.47 47.66,26.08 | IC2.THERMAL 47.66,26.08 | 33.56,53.8 33.56,53.93 U4.3 | 47.66,26.08 46.79,25.2 IC2.23 | Y4.2 40.43,28.67 39.67,29.42 39.67,29.43 39.66,29.44 39.67,29.46 39.67,30.31 39.8,30.45 41.69,30.45 43.29,28.85 45.67,28.85 IC2.15 48.29,28.7 IC2.THERMAL 51.29,29.7 IC2.43 53.83,29.7 54.82,30.68 v54.82,30.77 | 29.63,46.77 U4.16 | 29.63,46.77 30.14,46.77 30.68,46.23 31.2,46.23 U4.19 | C3.2 50.67,34.41 52.34,34.41 54.37,32.39 v54.37,32.08 | 33.56,53.8 35.01,55.25 35.01,55.29 | C3.2 50.76,34.51 v50.76,35.16 | v48.55,35.24 48.3,35.49 v46.82,35.49
  Top 0.2: C22.2 21.73,45.83 C21.2 23.64,45.52 R12.1 24.02,46.22 | v28.46,54.92 26.03,57.35 25.08,57.35 24.33,58.1 C37.2 | 32.21,51.04 v32.35,51.04 | 33.07,39.83 v33.07,40.18 C24.2 33.08,40.27 C23.2 C35.2 38.11,40.22 25MHZ.4 41.46,41.97 41.46,42.52 | 41.46,42.52 25MHZ.2 | 41.46,42.52 42.62,42.52 C36.2 44.66,42.02 v44.82,42.18 | C5.1 48.76,48.77 48.76,42.91 v48.82,42.84 49.79,41.87 51.4,41.87 51.75,41.52 U5.11 59.64,41.52 v60.03,41.91
  Top 0.305: C5.1 50.4,50.53 C4.2 51.44,51.89 B1.GND@0 B1.GND@1
  Top 0.508: IC2.THERMAL 49.57,27.98 49.79,27.98
  Bottom 0.152: 30.24,53.15 v32.35,51.04 | 54.57,31.89 v54.37,32.08 54.37,31.21 v54.82,30.77 | v48.55,35.24 49.61,35.24 49.64,35.21 50.71,35.21 v50.76,35.16 | v48.82,42.84 48.82,39.32 47.55,38.04 47.55,37.16 46.82,36.43 v46.82,35.49 | JP1.1 33.07,39.83 v33.07,40.18
  Bottom 0.2: 30.24,53.15 29.93,53.15 29.59,53.49 29.59,53.79 v28.46,54.92 | v44.82,42.18 48.16,42.18 v48.82,42.84 | v60.03,41.91 60.03,38.89 JP1.13
  other vias: 4.45,24.13 4.45,25.4 4.45,26.67 4.45,27.94 5.71,27.94 5.71,26.67 5.71,25.4 5.71,24.13 5.71,22.86 6.99,22.86 6.99,24.13 6.99,25.4 8.26,25.4 6.99,26.67 6.99,27.94 8.26,27.94 9.53,27.94 8.26,26.67 9.53,26.67 9.53,25.4 10.79,25.4 10.79,24.13 9.53,24.13 8.26,24.13 8.26,22.86 9.53,22.86 10.79,22.86
  pour Top: 3.17,15.24 3.17,73.34 95.88,73.66 95.88,-2.54 26.04,-2.54 26.04,15.24 29.84,15.24 29.84,29.53 12.06,29.53 12.06,21.59 6.99,21.59 6.99,15.24
  pour Bottom: 3.17,15.24 3.17,28.89 12.06,28.89 12.06,21.59 6.99,21.59 6.99,15.24
INT
  Top 0.152: U4.36 42.06,49 R3.1
LNKLED  (via drill 0.35)
  Top 0.152: v22.59,48.92 21.75,49.76 15.62,49.76 15.06,50.32 13.97,50.32 13.87,50.32 13.75,50.32 12.25,48.82 10.61,48.82 9.54,49.89 X2.14 9.17,49.89 | v28.89,50.43 27.39,48.94 v24.85,48.94 | 36.02,45.2 U4.25 35.4,45.73 35.4,45.97 v32.29,49.09
  Bottom 0.152: v28.89,50.43 29.11,50.21 31.9,50.21 31.91,50.2 31.93,50.2 32.26,49.87 32.26,49.41 32.24,49.4 32.24,49.38 32.29,49.34 v32.29,49.09 | v22.59,48.92 22.61,48.94 v24.85,48.94
MISO  (via drill 0.35)
  Top 0.152: v50.82,47.41 52.22,47.41 U5.20 | 46.77,31.15 IC2.11 46.79,31.34 41.74,36.4 39.66,36.4 JP1.4 38.46,35.18 38.6,35.03 38.6,34.57 35.83,31.8 B1.MISO
  Bottom 0.152: v50.82,47.41 49.73,47.41 49.37,47.05 49.37,46.9 47.93,45.46 47.47,45.46 47.4,45.54 42.78,45.54 42.73,45.48 41.51,45.48 38.43,42.41 38.43,37.62 JP1.4
MISO_WIZ
  Top 0.152: U5.1 40.12,47.37 U4.34
MOSI  (via drill 0.35)
  Top 0.152: v49.93,46.82 50.65,46.82 51.4,46.08 U5.18 | IC2.10 47.29,31.52 47.14,31.67 41.22,37.6 JP1.5 39.96,37.6 38.9,38.67 38.01,38.67 37.39,38.04 37.39,36.97 36.66,36.25 31.34,36.25 30.6,35.51 27.95,35.51 26.78,34.34 B1.MOSI
  Bottom 0.152: JP1.5 41,43.32 42.83,45.15 48.06,45.15 48.14,45.23 48.34,45.23 v49.93,46.82
MOSI_WIZ  (via drill 0.35)
  Top 0.152: v47.7,46.02 46.48,46.02 U5.3 | U4.35 39.6,48.64 40.14,48.11 45.61,48.11 v45.72,48
  Bottom 0.152: v45.72,48 v47.7,46.02
N$6
  Top 0.152: R5.2 8.49,36.37 X3.D+
N$9
  Top 0.2: 9.4,64.69 11.83,64.69 12.41,65.28 R1.2
  Top 0.203: 9.4,64.69 8.9,64.69 X2.11
N$10
  Top 0.2: 6.46,47.55 R2.2
  Top 0.203: X2.13 7.03,52.43 6.03,51.44 6.03,47.98 6.46,47.55
N$11
  Top 0.152: Y4.3 41.77,29.87 43.47,28.17 45.78,28.17 IC2.16
N$12
  Top 0.152: IC2.17 43.01,27.7 42.93,27.79 41.07,27.79 Y4.1
N$13
  Top 0.152: R4.2 8.11,37.02 X3.D-
N$18  (via drill 0.35)
  Top 0.152: C21.1 22.13,47.66 v22.3,47.84 | v27.4,45.24 30.92,45.24 U4.20
  Bottom 0.152: v27.4,45.24 25.92,46.73 23.65,46.73 22.54,47.84 v22.3,47.84
N$19
  Top 0.152: C22.1 20.59,45.52 21.67,44.43 31.53,44.43 U4.22
N$20  (via drill 0.35)
  Top 0.152: R12.2 25.77,45.9 v26.93,47.06 | U4.10 30.43,51.99 v31.31,51.12
  Bottom 0.152: v31.31,51.12 26.93,51.12 25.81,50 | 25.81,50 25.81,49.92 | 25.81,49.92 25.81,48.18 v26.93,47.06 | 25.81,49.92 25.81,50
N$23
  Top 0.152: C40.1 24.02,48.6 23.42,49.2 23.39,49.2 23.25,49.33 23.25,51.17 R21.1 R22.1
N$25  (via drill 0.35)
  Top 0.152: 25MHZ.3 38.65,42.57 C35.1 37.55,42.47 v37.02,42.48 | v35.85,48.64 36.73,48.64 U4.31
  Bottom 0.152: v37.02,42.48 35.85,43.71 v35.85,48.64
N$26  (via drill 0.35)
  Top 0.152: C36.1 43.01,40.22 25MHZ.1 41.19,40.22 40.36,39.39 37.72,39.39 37.7,39.37 36.87,39.37 v36.79,39.44 | v36.53,47.88 36.79,47.88 U4.30
  Bottom 0.152: v36.79,39.44 36.79,41.41 37.63,42.25 37.63,42.7 36.87,43.46 36.87,47.54 v36.53,47.88
POE_VIN+
  Top 0.508: U$1.VIN+2 U$1.VIN+1 1.14,9.46 1.14,53.53 2.07,54.45 18.24,54.45 18.71,53.98 18.73,53.98 20.32,52.39 X2.9
POE_VIN-  (via drill 0.35)
  Bottom 0.508: X2.10 14.48,50.8 12.32,52.96 10.54,52.96 8.63,51.05 3.42,51.05 1.91,49.53 1.91,15.56 3.49,13.97 v10.79,13.97
  other vias: 10.79,16.51 12.06,16.51 13.34,16.51 10.79,15.24 12.06,15.24 13.34,15.24 13.34,13.97 12.06,13.97 14.61,13.97 15.88,13.97 17.14,13.97 14.61,12.7 15.88,12.7 17.14,12.7 17.14,11.43 15.88,11.43 14.61,11.43 10.79,12.7 12.06,12.7 13.34,12.7 12.06,11.43 13.34,11.43 13.34,10.16 12.06,10.16 10.79,8.89 12.06,8.89 13.34,8.89 15.88,6.35 17.14,6.35 15.88,5.08 17.14,5.08 14.61,10.16 15.88,10.16 17.14,10.16 14.61,8.89 15.88,8.89 17.14,8.89 17.14,7.62 15.88,7.62 14.61,7.62 18.41,10.16 19.68,10.16 20.95,10.16 18.41,8.89 19.68,8.89 20.95,8.89 20.95,7.62 19.68,7.62 18.41,7.62 18.41,13.97 19.68,13.97 20.95,13.97 18.41,12.7 19.68,12.7 20.95,12.7 20.95,11.43 19.68,11.43 18.41,11.43 22.22,13.97 23.49,13.97 22.22,12.7 23.49,12.7 23.49,11.43 22.22,11.43 18.41,6.35 19.68,6.35 20.95,6.35 18.41,5.08 19.68,5.08 20.95,5.08 22.22,6.35 23.49,6.35 22.22,5.08 23.49,5.08 22.22,10.16 23.49,10.16 22.22,8.89 23.49,8.89 23.49,7.62 22.22,7.62 10.79,11.43
  pour Top: 9.53,17.78 9.53,2.54 24.76,2.54 24.76,15.24 14.61,15.24 14.61,17.78
  pour Bottom: 9.53,17.78 9.53,2.54 24.76,2.54 24.76,15.24 14.61,15.24 14.61,17.78
RD+  (via drill 0.35)
  Bottom 0.152: C38.2 24.03,50.1 22.59,51.54 22.59,59.96 X2.1
  other vias: 24.03,49.92
RD-
  Top 0.152: C39.2 20.09,56.06 19.39,56.76 19.39,58.72 18.1,60.01 18.1,60.64 X2.2
RDN
  Top 0.152: R22.2 28.99,54.01 29.84,54.86 31.21,54.86 U4.5
  Top 0.2: R22.2 C39.1
RDP
  Top 0.152: R21.2 27.58,51.97 30.02,54.4 30.97,54.4 U4.6
  Top 0.2: R21.2 25.74,49.96 C38.1
RST  (via drill 0.35)  (2 unrouted)
  Top 0.152: B1.RES 68.93,49.81 JP1.16 68.93,35.6 64.65,31.32 53.8,31.32 v53.76,31.37 | IC2.13 46.38,29.7 46.71,30.04 46.71,30.15 46.8,30.23 | 46.8,30.23 46.87,30.3 51.72,30.3 51.87,30.45 52.06,30.45 52.46,30.85 v52.58,30.85 | v32.14,36.8 31.9,37.04 31.9,38.04 31.28,38.67 30.39,38.67 28.61,36.88 B1.RST_ICSP | v32.52,29.98 32.87,30.33 35.22,30.33 37.83,32.94 43.17,32.94 45.46,30.65 46.38,30.65 46.8,30.23
  Bottom 0.152: v52.58,30.85 53.2,30.81 v53.76,31.37 | v32.14,36.8 32.52,36.42 v32.52,29.98
SCK  (via drill 0.35)
  Top 0.152: U5.17 52.22,45.46 51.36,45.46 50.62,46.2 v50.45,46.2 | IC2.9 47.79,31.53 47.51,31.81 47.48,31.81 44.15,35.13 v44.15,35.93 v44.15,35.94 43.54,36.55 JP1.6 | v41.7,33.66 38.13,33.66 35.09,30.63 27.95,30.63 27.27,31.32 27.27,32.28 28.43,33.45 B1.SCK
  Bottom 0.152: v50.45,46.2 50.4,46.2 49.05,44.85 43.52,44.85 43.34,44.66 43.34,37.8 JP1.6 | v41.7,33.66 43.97,35.94 v44.15,35.94
SCK_WIZ
  Top 0.152: U5.4 44.61,45.42 43.21,46.82 39.96,46.82 U4.33
SCSN  (via drill 0.35)
  Top 0.152: v54.87,40.54 45.43,40.54 44.97,40.07 44.97,34.85 45.03,34.78 48.14,31.67 48.14,31.32 IC2.8 | U5.16 v53.57,44.77
  Bottom 0.152: v54.87,40.54 53.57,41.84 v53.57,44.77
SCSN_WIZ  (1 unrouted)
  Top 0.152: U5.5 44.64,44.77 42.99,46.42 39.66,46.42 U4.32
TDN  (via drill 0.35)
  Top 0.152: 33.16,55.75 U4.1 32.57,56.34 v29.81,56.34 | R20.1 24.03,59.6 v24.53,59.09 | X2.6 19.84,55.88 19.97,55.75 22.98,55.75 23.4,55.33 23.47,55.33 v23.81,54.99
  Bottom 0.152: v29.81,56.34 28.7,57.44 26.66,57.44 25.01,59.09 v24.53,59.09 23.81,58.37 v23.81,54.99
TDP  (via drill 0.35)
  Top 0.152: v31.64,55.72 32.7,55.5 U4.2 | X2.5 20.32,57.79 22.22,59.69 22.22,60.38 R19.1 24.02,61.97 v24.77,61.23
  Bottom 0.152: v24.77,61.23 27.21,58.78 27.83,58.78 28.09,58.52 28.84,58.52 v31.64,55.72
VBAT  (via drill 0.35)  (9 unrouted)
  other vias: 22.22,21.13
VBUS  (via drill 0.35)  (55 unrouted)
  Top 0.152: IC2.7 48.77,31.2
  Top 0.203: v48.68,31.99 48.68,31.95 48.87,31.77 48.87,31.25 IC2.7
  Top 0.254: v57.66,40.27 57.35,39.96 57.35,37.14 54.1,33.89 v53.7,33.89 | 54.07,59.6 v54.07,56.57
  Top 0.305: 28.08,15.27 v30.76,15.27 | 47.92,61.26 52.28,61.26 53.94,59.6 54.07,59.6
  Bottom 0.203: 53.62,17.02 JP3.3
  Bottom 0.254: v57.66,40.27 57.66,52.97 v54.07,56.57 | 48.77,27.87 48.68,27.95 v48.68,31.99 49.2,31.47 51.07,31.47 52.37,32.78 52.59,32.78 v53.7,33.89
  Bottom 0.305: 48.77,27.87 53.62,23.02 JP3.3 53.46,17.27 49.13,12.94 47.6,12.94 45.27,15.27 v30.76,15.27
  other vias: 15.88,22.86 15.88,24.13 15.88,25.4 17.14,25.4 17.14,26.67 17.14,27.94 17.14,22.86 17.14,24.13 18.41,22.86 18.41,24.13 18.41,25.4 18.41,26.67 18.41,27.94 19.68,27.94 19.68,26.67 19.68,25.4 19.68,24.13 20.95,24.13 20.95,25.4 20.95,26.67 20.95,27.94 22.22,27.94 22.22,26.67 22.22,25.4 22.22,24.13 23.49,20.32 23.49,21.59 23.49,22.86 23.49,24.13 23.49,25.4 23.49,26.67 23.49,27.94 24.76,27.94 24.76,26.67 24.76,25.4 24.76,24.13 24.76,22.86 24.76,21.59 24.76,20.32 26.04,20.32 26.04,21.59 26.04,22.86 26.04,24.13 26.04,25.4 26.04,26.67 26.04,27.94 27.3,20.32 27.3,21.59 27.3,22.86 27.3,24.13 27.3,25.4 27.3,26.67 27.3,27.94
  pour Top: 14.61,21.59 14.61,28.89 28.71,28.89 28.57,19.05 18.41,19.05 18.41,21.59
  pour Bottom: 14.61,21.59 14.61,28.89 28.57,28.89 28.57,19.05 18.41,19.05 18.41,21.59
VCC-ISO  (via drill 0.35)  (18 unrouted)
  Top 0.152: U5.19 52.31,46.77 52.41,46.67 v53.45,46.67 | IC2.34 IC2.33 51.79,24.62 51.48,24.93 47.36,24.93 47.29,24.86 IC2.24 | IC2.44 53.55,30.2 v53.79,30.45 | C3.1 48.82,34.73 v49.87,35.77
  Top 0.2: 52.31,46.77 52.51,46.97 52.86,46.97 53.01,47.12 53.01,47.63 52.86,47.78 51.45,47.78 C5.2
  Bottom 0.152: 49.97,35.88 v49.87,35.77 50.09,35.99 50.09,38.04 50.57,38.52 50.57,39.77 53.01,42.21 53.01,45 53.45,45.44 v53.45,46.67
  pour Bottom: 17.14,77.47 17.14,29.53 29.84,29.53 29.84,17.78 26.04,17.78 26.04,-1.27 100.96,-1.27 100.96,77.47
VCCA  (via drill 0.35)
  Top 0.152: v28.2,48.51 30.23,50.54 30.25,50.54 30.59,50.88 30.59,51.07 30.08,51.58 U4.11 30.08,51.93 29.57,52.44 29.57,53.05 v30.3,53.79 30.3,53.65 U4.8 | v28.87,47.28 29.43,47.28 U4.15 30.61,48.29 31.12,48.8 31.31,48.8 31.65,48.45 31.65,48.44 31.71,48.38 31.71,48.15 31.26,47.7 | R19.2 25.77,62.18 | C37.1 25.84,58 v26.89,58 26.89,57.58 v29.26,55.21 31.37,55.21 31.4,55.17 31.62,55.17 U4.4 | 31.26,47.7 U4.17 31.31,47.58 31.44,47.7 | 32.02,48.09 33.08,47.04 33.08,46.69 U4.21 | 41.34,49.97 v34.98,49.97 | 31.44,47.7 31.82,48.09 32.02,48.09 | 31.44,47.7 31.26,47.7 | v32.2,48.27 32.02,48.09
  Top 0.2: R19.2 25.77,62.18 | C37.1 R20.2 25.73,62.16 25.72,62.16 R19.2 C9.1 C10.1 25.73,66.28 C25.1 25.75,68.33 L2.2
  Bottom 0.152: v28.2,48.51 28.2,47.95 v28.87,47.28 | v29.26,55.21 29.26,54.83 v30.3,53.79 | v34.98,49.97 33.27,48.27 v32.2,48.27
WIZ_RST  (via drill 0.35)
  Top 0.152: U5.15 51.49,44.12 51.11,43.74 v51.11,42.45 | IC2.22 45.32,24.71 v43.86,24.71
  Bottom 0.152: v51.11,42.45 49.68,41.03 49.68,38.04 49.68,37.16 49.06,36.53 | 49.06,36.53 49.05,36.53 | v43.86,24.71 43.86,29.16 42.86,30.16 42.86,31.28 45.08,33.5 46.02,33.5 48.32,35.8 49.06,36.53
WIZ_RST_WIZ  (via drill 0.35)  (1 unrouted)
  Top 0.152: U5.6 40.81,44.12 v38.8,46.14 | v37.78,50.79 39.3,50.79 U4.37
  Bottom 0.152: v38.8,46.14 38.8,49.77 v37.78,50.79

### Text on the board
tPlace: + | A5 | + | A4 | + | A3 | + | A2 | + | A1 | + | A0 | 13 | 12 | 11 | 10 | 9 | 0 | 1 | 2 | 3 | 4 | 5 | 6 | 7 | 8
Document: + | + | + | + | + | +